# EAGLE design Swarm Board_3 (EAGLE 6.5.0)
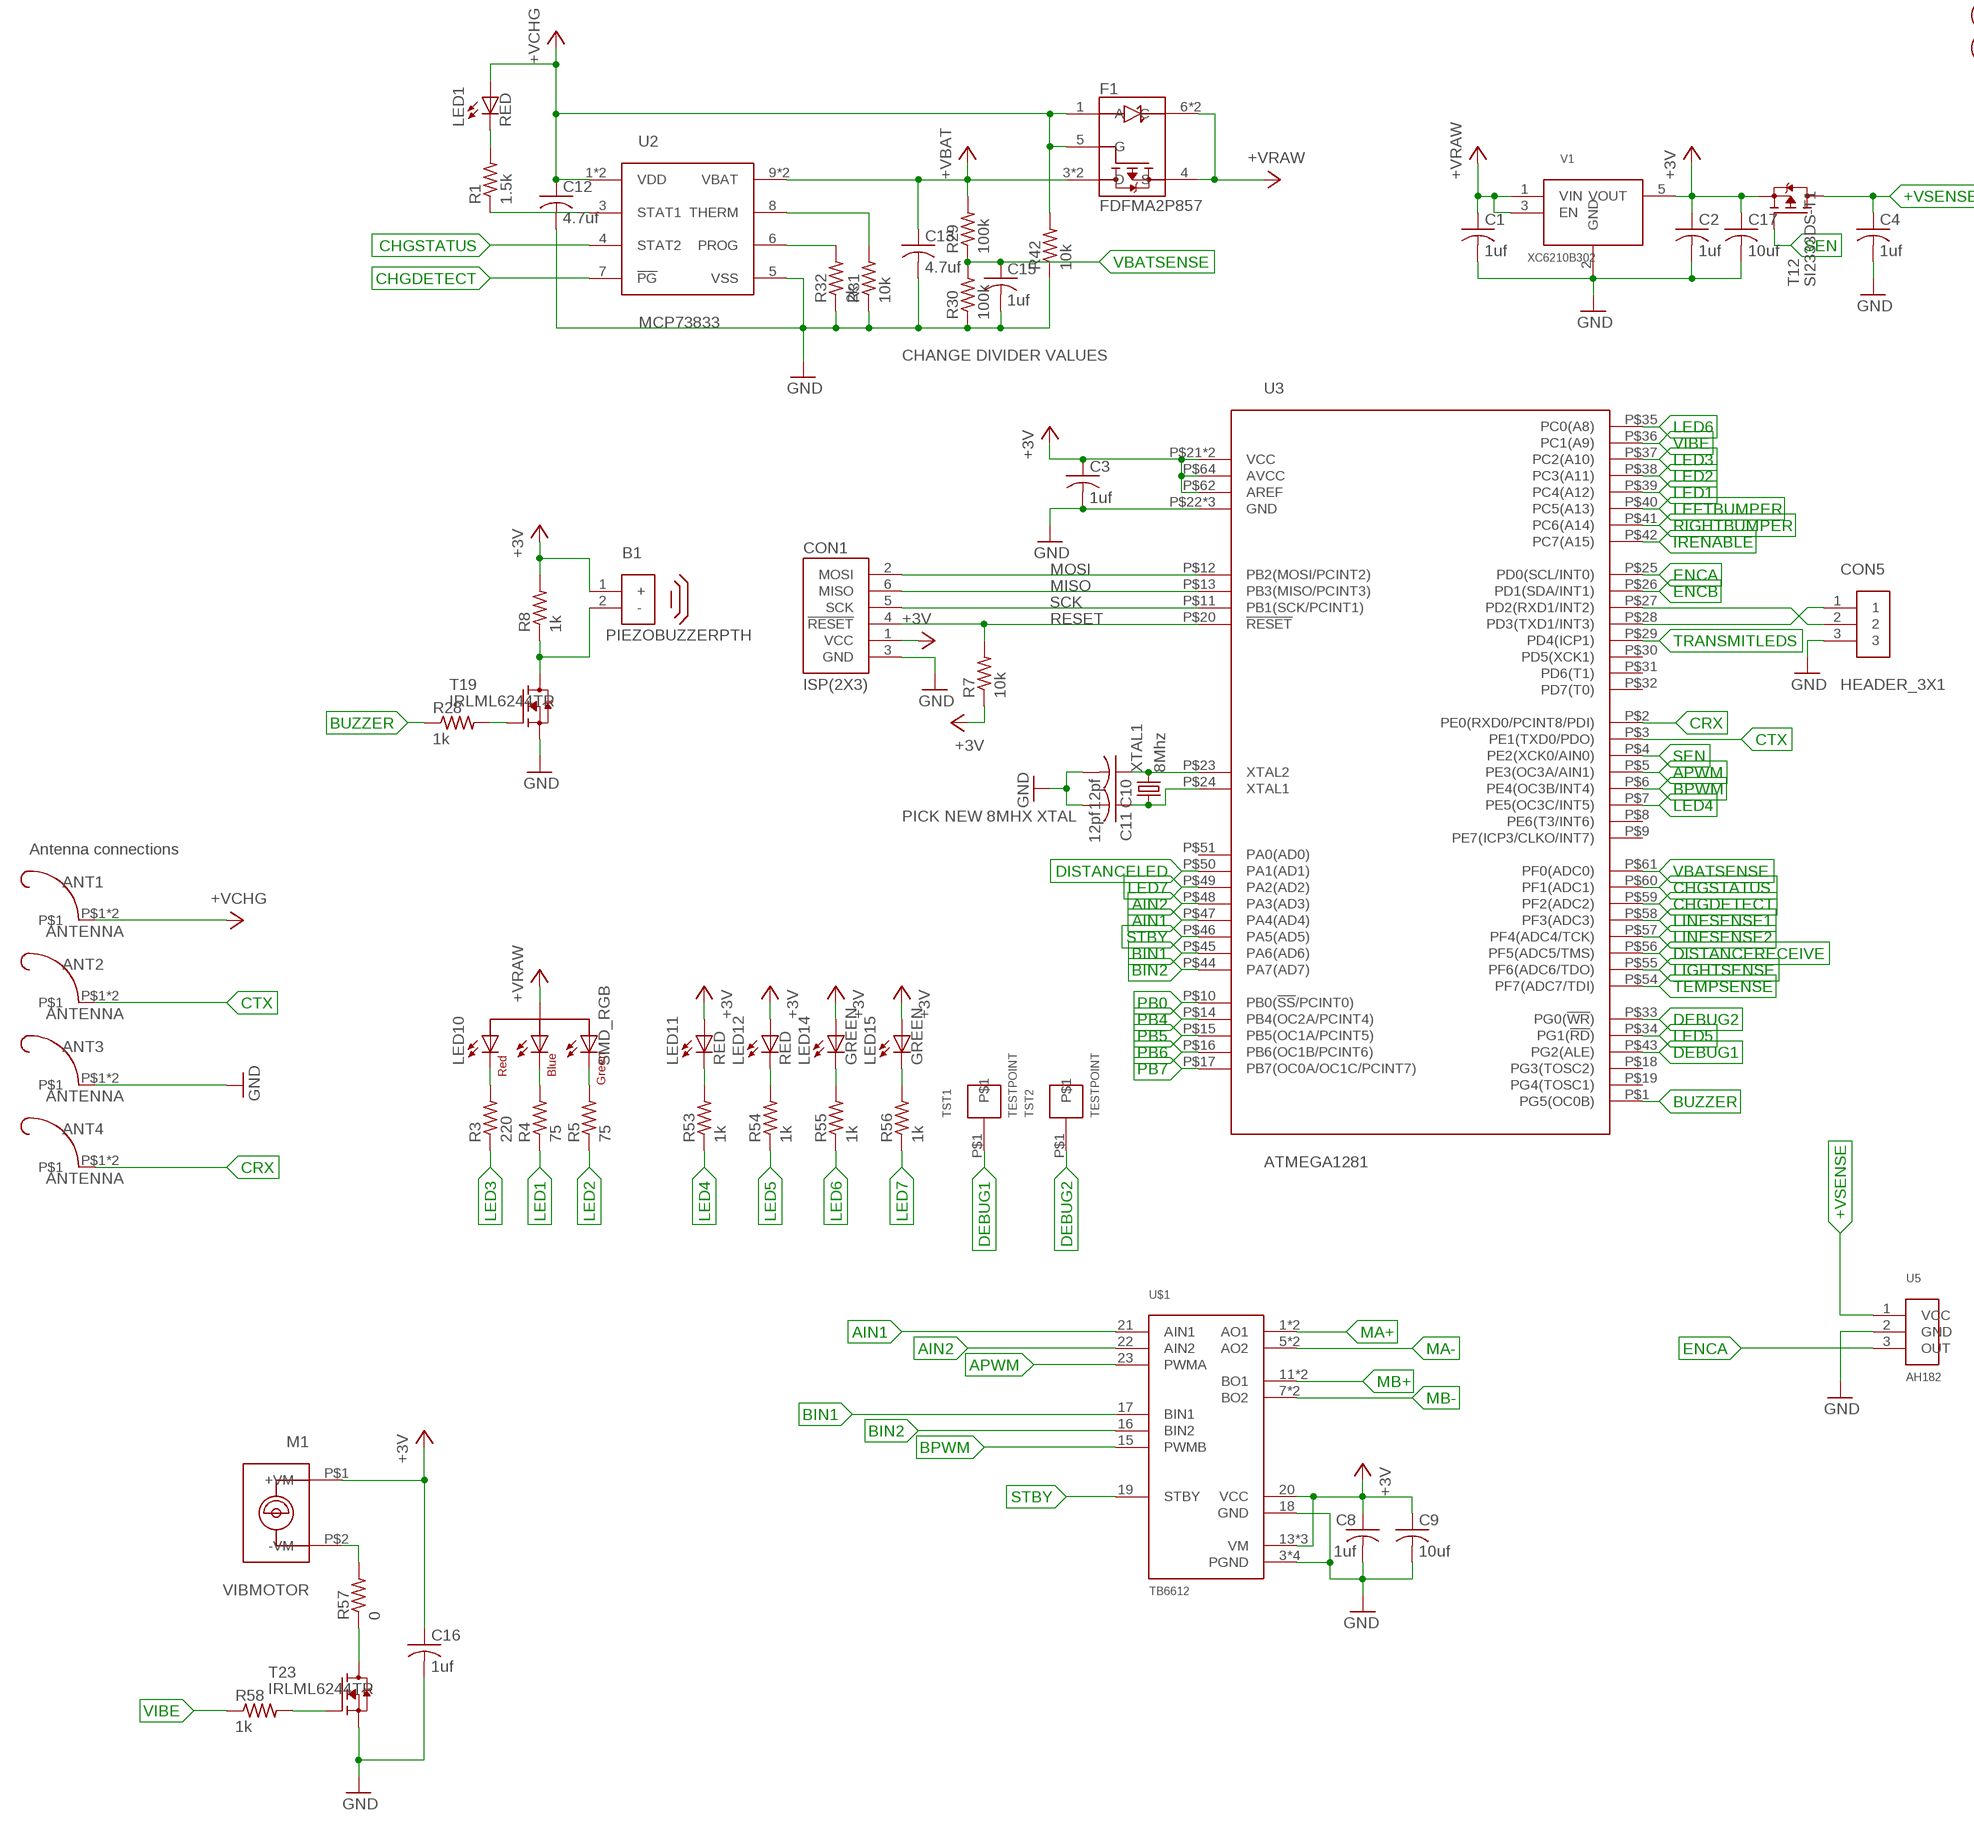
[diagram p0: schematic, sheet 1, part 1 of 2]
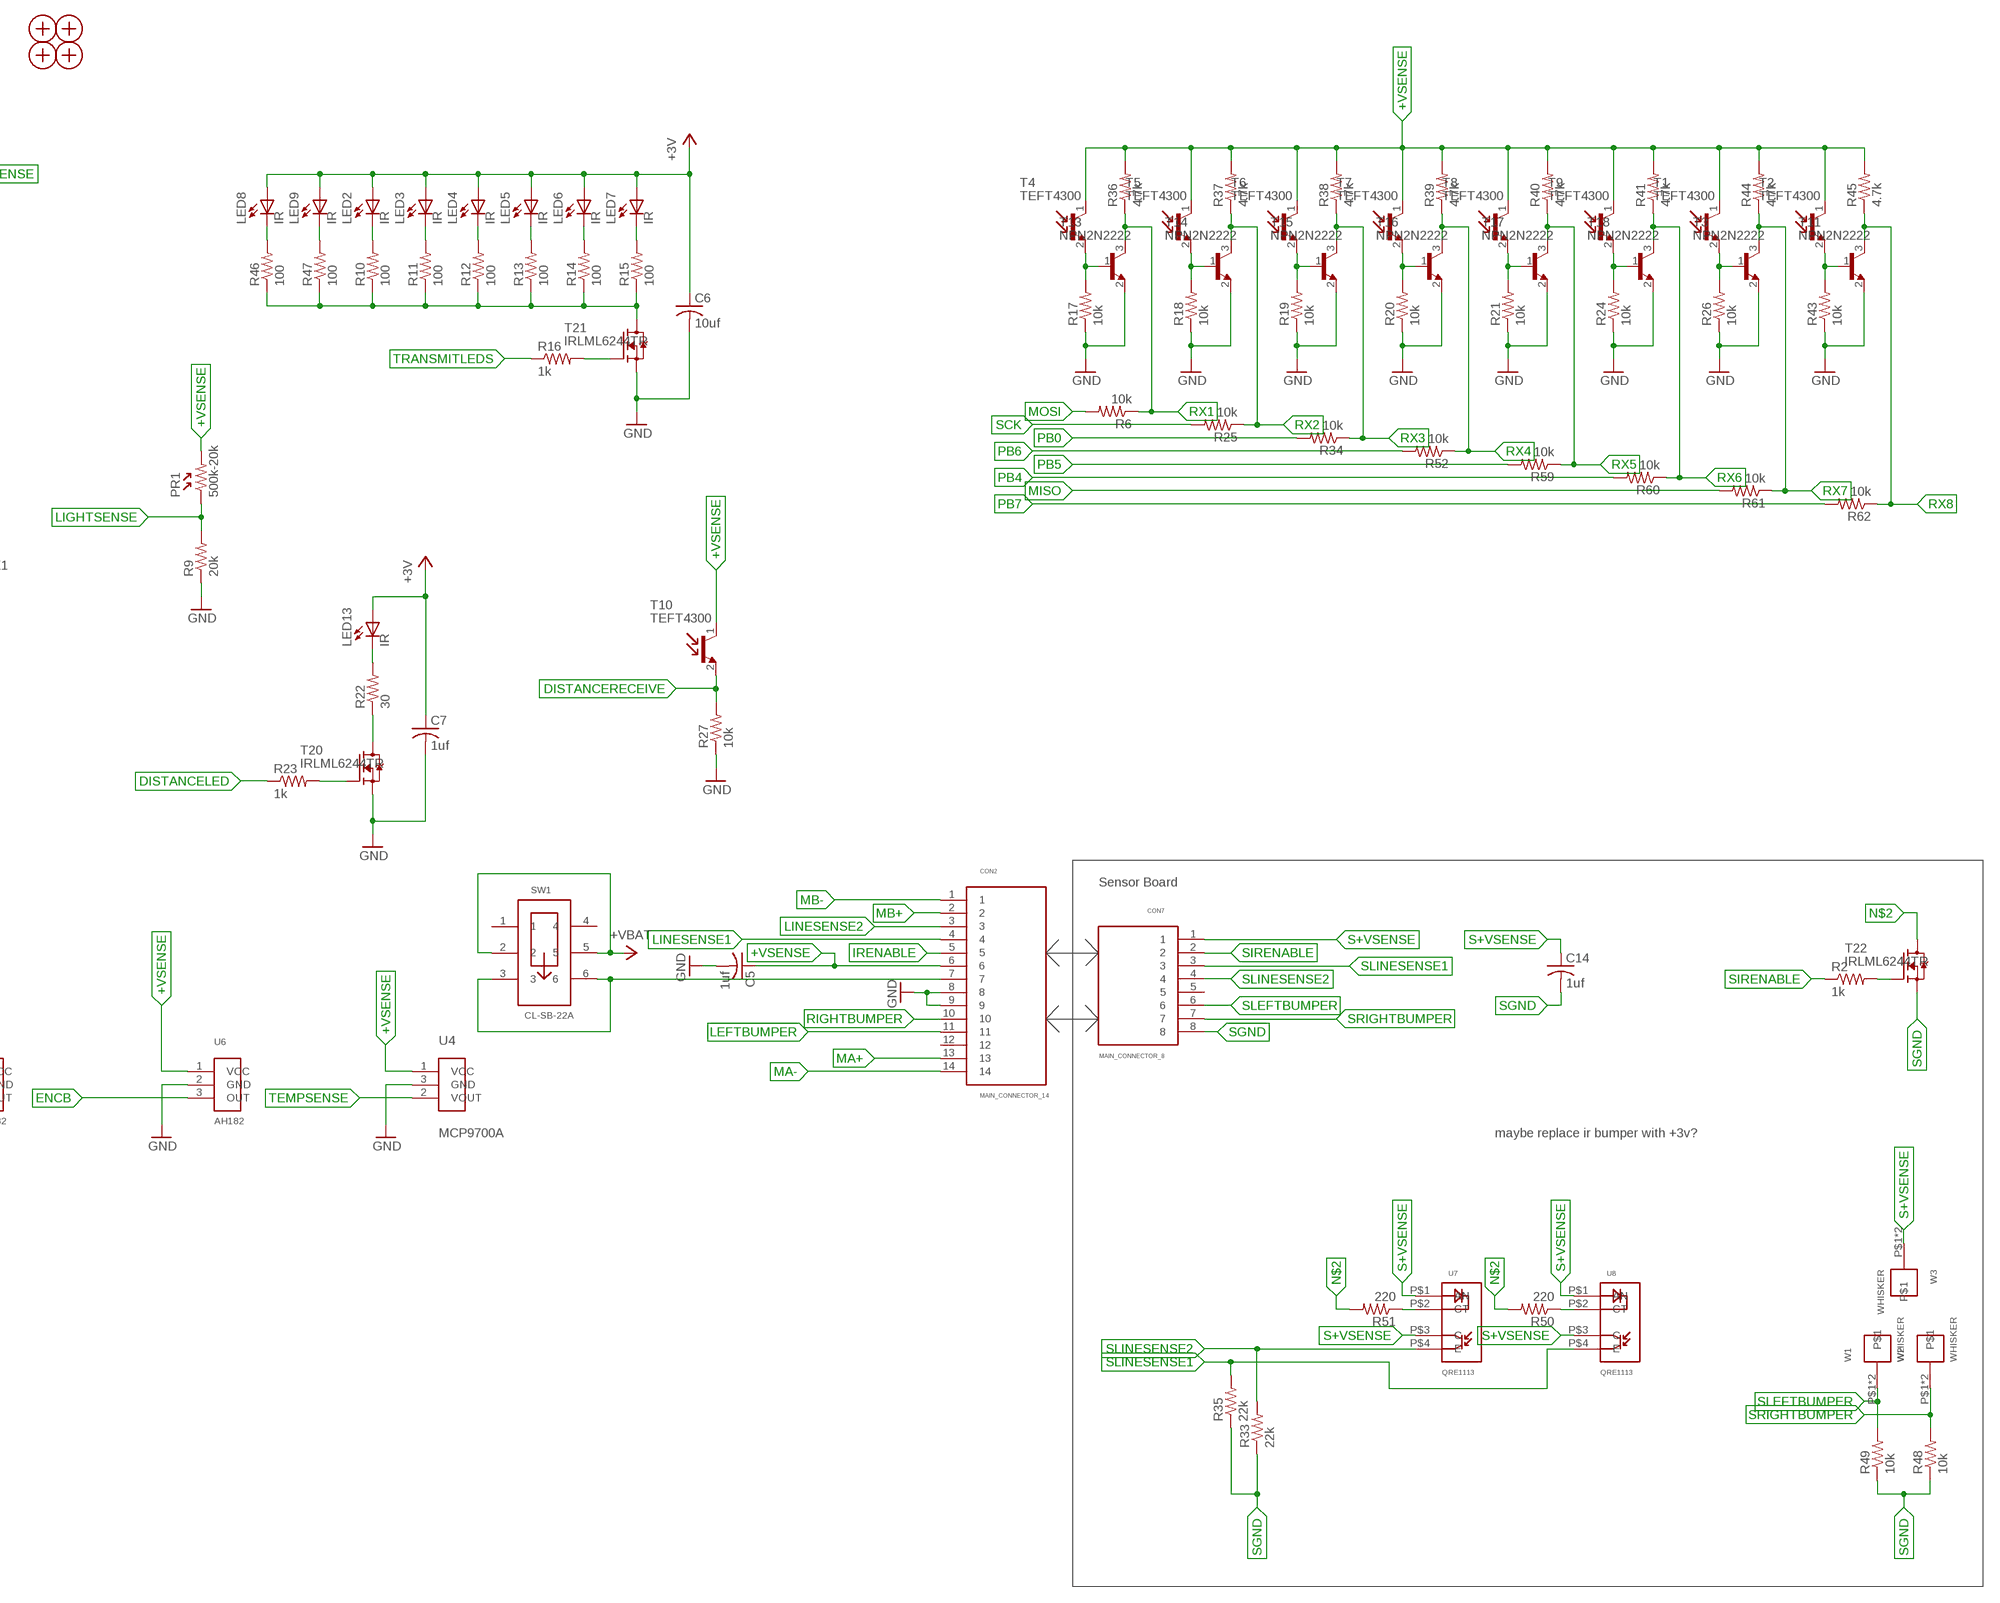
[diagram p1: schematic, sheet 1, part 2 of 2]

## Parts
ANT1  ANTENNA  [ANTENNA]
ANT2  ANTENNA  [ANTENNA]
ANT3  ANTENNA  [ANTENNA]
ANT4  ANTENNA  [ANTENNA]
B1  PIEZOBUZZERPTH  [PIEZOBUZZER]
C1  1uf  CAP0603  [0603]
C2  1uf  CAP0603  [0603]
C3  1uf  CAP0603  [0603]
C4  1uf  CAP0603  [0603]
C5  1uf  CAP0603  [0603]
C6  10uf  CAP0805  [0805]
C7  1uf  CAP0603  [0603]
C8  1uf  CAP0603  [0603]
C9  10uf  CAP0805  [0805]
C10  12pf  CAP0603  [0603]
C11  12pf  CAP0603  [0603]
C12  4.7uf  CAP0603  [0603]
C13  4.7uf  CAP0603  [0603]
C14  1uf  CAP0603  [0603]
C15  1uf  CAP0603  [0603]
C16  1uf  CAP0603  [0603]
C17  10uf  CAP0805  [0805]
CON1  ISP(2X3)  [PINHEADER(2X3)]
CON2  MAIN_CONNECTOR_14  [FEMALE_HEADER_2MM_2X7_SMD]
CON5  HEADER_3X1  [3PINHEADER_.100"]
CON7  MAIN_CONNECTOR_8  [FEMALE_HEADER_2MM_2X4]
F1  FDFMA2P857  [MICROFET2X2MM]
H1  MOUNTINGHOLE  [MOUNTINGHOLE]
H2  MOUNTINGHOLE  [MOUNTINGHOLE]
H3  MOUNTINGHOLE  [MOUNTINGHOLE]
H4  MOUNTINGHOLE  [MOUNTINGHOLE]
LED1  RED  LED0603  [LED0603]
LED2  IR  LED5MMRA  [5MM_LED_RA]
LED3  IR  LED5MMRA  [5MM_LED_RA]
LED4  IR  LED5MMRA  [5MM_LED_RA]
LED5  IR  LED5MMRA  [5MM_LED_RA]
LED6  IR  LED5MMRA  [5MM_LED_RA]
LED7  IR  LED5MMRA  [5MM_LED_RA]
LED8  IR  LED5MMRA  [5MM_LED_RA]
LED9  IR  LED5MMRA  [5MM_LED_RA]
LED10  SMD_RGB  [PLCC4]
LED11  RED  LED0603  [LED0603]
LED12  RED  LED0603  [LED0603]
LED13  IR  LED5MMRA  [5MM_LED_RA]
LED14  GREEN  LED0603  [LED0603]
LED15  GREEN  LED0603  [LED0603]
M1  VIBMOTOR  [VIBMOTOR]
PR1  500k-20k  CDSPHOTORESISTOR  [CDSPHOTOCELL]
R1  1.5k  RES0603  [0603]
R2  1k  RES0603  [0603]
R3  220  RES0603  [0603]
R4  75  RES0603  [0603]
R5  75  RES0603  [0603]
R6  10k  RES0603  [0603]
R7  10k  RES0603  [0603]
R8  1k  RES0603  [0603]
R9  20k  RES0603  [0603]
R10  100  RES0603  [0603]
R11  100  RES0603  [0603]
R12  100  RES0603  [0603]
R13  100  RES0603  [0603]
R14  100  RES0603  [0603]
R15  100  RES0603  [0603]
R16  1k  RES0603  [0603]
R17  10k  RES0603  [0603]
R18  10k  RES0603  [0603]
R19  10k  RES0603  [0603]
R20  10k  RES0603  [0603]
R21  10k  RES0603  [0603]
R22  30  RES0603  [0603]
R23  1k  RES0603  [0603]
R24  10k  RES0603  [0603]
R25  10k  RES0603  [0603]
R26  10k  RES0603  [0603]
R27  10k  RES0603  [0603]
R28  1k  RES0603  [0603]
R29  100k  RES0603  [0603]
R30  100k  RES0603  [0603]
R31  10k  RES0603  [0603]
R32  2k  RES0603  [0603]
R33  22k  RES0603  [0603]
R34  10k  RES0603  [0603]
R35  22k  RES0603  [0603]
R36  4.7k  RES0603  [0603]
R37  4.7k  RES0603  [0603]
R38  4.7k  RES0603  [0603]
R39  4.7k  RES0603  [0603]
R40  4.7k  RES0603  [0603]
R41  4.7k  RES0603  [0603]
R42  10k  RES0603  [0603]
R43  10k  RES0603  [0603]
R44  4.7k  RES0603  [0603]
R45  4.7k  RES0603  [0603]
R46  100  RES0603  [0603]
R47  100  RES0603  [0603]
R48  10k  RES0603  [0603]
R49  10k  RES0603  [0603]
R50  220  RES0603  [0603]
R51  220  RES0603  [0603]
R52  10k  RES0603  [0603]
R53  1k  RES0603  [0603]
R54  1k  RES0603  [0603]
R55  1k  RES0603  [0603]
R56  1k  RES0603  [0603]
R57  0  RES0603  [0603]
R58  1k  RES0603  [0603]
R59  10k  RES0603  [0603]
R60  10k  RES0603  [0603]
R61  10k  RES0603  [0603]
R62  10k  RES0603  [0603]
SW1  CL-SB-22A  [CL-SB-22A-01T]
T1  TEFT4300  [3MM_LED_RA]
T2  TEFT4300  [3MM_LED_RA]
T3  NPN2N2222  [SOT23]
T4  TEFT4300  [3MM_LED_RA]
T5  TEFT4300  [3MM_LED_RA]
T6  TEFT4300  [3MM_LED_RA]
T7  TEFT4300  [3MM_LED_RA]
T8  TEFT4300  [3MM_LED_RA]
T9  TEFT4300  [3MM_LED_RA]
T10  TEFT4300  [3MM_LED_RA]
T11  NPN2N2222  [SOT23]
T12  SI2333DS-T1  [SOT23]
T13  NPN2N2222  [SOT23]
T14  NPN2N2222  [SOT23]
T15  NPN2N2222  [SOT23]
T16  NPN2N2222  [SOT23]
T17  NPN2N2222  [SOT23]
T18  NPN2N2222  [SOT23]
T19  IRLML6244TR  [SOT23]
T20  IRLML6244TR  [SOT23]
T21  IRLML6244TR  [SOT23]
T22  IRLML6244TR  [SOT23]
T23  IRLML6244TR  [SOT23]
TST1  TESTPOINT  [TESTPOINT]
TST2  TESTPOINT  [TESTPOINT]
U2  MCP73833  [MSOP10]
U3  ATMEGA1281  [TQFP64]
U4  MCP9700A  [SOT23]
U5  AH182  [3PINHEADER_.100"]
U6  AH182  [3PINHEADER_.100"]
U7  QRE1113  [QRE1113]
U8  QRE1113  [QRE1113]
U$1  TB6612  [24SSOP]
V1  XC6210B302  [(OT)SOT-23(5PAD)]
W1  WHISKER  [WHISKER]
W2  WHISKER  [WHISKER]
W3  WHISKER  [WHISKER]
XTAL1  8Mhz  NX5032GA-10.000000MHZ  [SMDXTAL]

## Nets
+3V: B1.1(+) C2.1 C3.1 C6.1 C7.1 C8.1 C9.1 C16.1 C17.1 CON1.1(VCC) LED2.1(A) LED3.1(A) LED4.1(A) LED5.1(A) LED6.1(A) LED7.1(A) LED8.1(A) LED9.1(A) LED11.2(A) LED12.2(A) LED13.1(A) LED14.2(A) LED15.2(A) M1.P$1(+VM) R7.1 R8.2 T12.2(S) U3.P$21(VCC) U3.P$52(VCC) U3.P$62(AREF) U3.P$64(AVCC) U$1.13(VM) U$1.14(VM) U$1.20(VCC) U$1.24(VM) V1.5(VOUT)
+VBAT: C13.1 F1.3(D) F1.8(D) R29.2 SW1.2 SW1.5 U2.9(VBAT) U2.10(VBAT)
+VCHG: ANT1.P$1 ANT1.P$2 C12.1 F1.1(A) F1.5(G) LED1.2(A) R42.2 U2.1(VDD) U2.2(VDD)
+VRAW: C1.1 F1.4(S) F1.6(C) F1.7(C) LED10.2(COMMONANODE) V1.1(VIN) V1.3(EN)
+VSENSE: C4.1 C5.1 CON2.6 PR1.2 R36.2 R37.2 R38.2 R39.2 R40.2 R41.2 R44.2 R45.2 T1.1(C) T2.1(C) T4.1(C) T5.1(C) T6.1(C) T7.1(C) T8.1(C) T9.1(C) T10.1(C) T12.3(D) U4.1(VCC) U5.1(VCC) U6.1(VCC)
AIN1: U3.P$47(PA4(AD4)) U$1.21(AIN1)
AIN2: U3.P$48(PA3(AD3)) U$1.22(AIN2)
APWM: U3.P$5(PE3(OC3A/AIN1)) U$1.23(PWMA)
BIN1: U3.P$45(PA6(AD6)) U$1.17(BIN1)
BIN2: U3.P$44(PA7(AD7)) U$1.16(BIN2)
BPWM: U3.P$6(PE4(OC3B/INT4)) U$1.15(PWMB)
BUZZER: R28.1 U3.P$1(PG5(OC0B))
CHGDETECT: U2.7(!PG) U3.P$59(PF2(ADC2))
CHGSTATUS: U2.4(STAT2) U3.P$60(PF1(ADC1))
CRX: ANT4.P$1 ANT4.P$2 U3.P$2(PE0(RXD0/PCINT8/PDI))
CTX: ANT2.P$1 ANT2.P$2 U3.P$3(PE1(TXD0/PDO))
DATAANTENNA: CON5.1 U3.P$28(PD3(TXD1/INT3))
DEBUG1: TST1.P$1 U3.P$43(PG2(ALE))
DEBUG2: TST2.P$1 U3.P$33(PG0(!WR!))
DISTANCELED: R23.1 U3.P$50(PA1(AD1))
DISTANCERECEIVE: R27.2 T10.2(E) U3.P$56(PF5(ADC5/TMS))
ENCA: U3.P$25(PD0(SCL/INT0)) U5.3(OUT)
ENCB: U3.P$26(PD1(SDA/INT1)) U6.3(OUT)
GND: ANT3.P$1 ANT3.P$2 C1.2 C2.2 C3.2 C4.2 C5.2 C6.2 C7.2 C8.2 C9.2 C10.2 C11.2 C12.2 C13.2 C15.2 C16.2 C17.2 CON1.3(GND) CON2.8 CON2.9 CON5.3 R9.1 R17.1 R18.1 R19.1 R20.1 R21.1 R24.1 R26.1 R27.1 R30.1 R31.1 R32.1 R42.1 R43.1 T3.2(E) T11.2(E) T13.2(E) T14.2(E) T15.2(E) T16.2(E) T17.2(E) T18.2(E) T19.2(S) T20.2(S) T21.2(S) T23.2(S) U2.5(VSS) U3.P$22(GND) U3.P$53(GND) U3.P$63(GND) U4.3(GND) U5.2(GND) U6.2(GND) U$1.3(PGND) U$1.4(PGND) U$1.9(PGND) U$1.10(PGND) U$1.18(GND) V1.2(GND)
IRENABLE: CON2.5 U3.P$42(PC7(A15))
LED1: R4.1 U3.P$39(PC4(A12))
LED2: R5.1 U3.P$38(PC3(A11))
LED3: R3.1 U3.P$37(PC2(A10))
LED4: R53.1 U3.P$7(PE5(OC3C/INT5))
LED5: R54.1 U3.P$34(PG1(!RD!))
LED6: R55.1 U3.P$35(PC0(A8))
LED7: R56.1 U3.P$49(PA2(AD2))
LEFTBUMPER: CON2.11 U3.P$40(PC5(A13))
LIGHTSENSE: PR1.1 R9.2 U3.P$55(PF6(ADC6/TDO))
LINESENSE1: CON2.4 U3.P$58(PF3(ADC3))
LINESENSE2: CON2.3 U3.P$57(PF4(ADC4/TCK))
MA+: CON2.13 U$1.1(AO1) U$1.2(AO1)
MA-: CON2.14 U$1.5(AO2) U$1.6(AO2)
MB+: CON2.2 U$1.11(BO1) U$1.12(BO1)
MB-: CON2.1 U$1.7(BO2) U$1.8(BO2)
MISO: CON1.6(MISO) R61.2 U3.P$13(PB3(MISO/PCINT3))
MOSI: CON1.2(MOSI) R6.2 U3.P$12(PB2(MOSI/PCINT2))
N$1: LED1.1(C) R1.2
N$2: R50.2 R51.2 T22.3(D)
N$3: R43.2 T2.2(E) T11.1(B)
N$4: R2.2 T22.1(G)
N$5: CON2.7 SW1.3 SW1.6
N$6: R26.2 T1.2(E) T3.1(B)
N$7: R57.1 T23.3(D)
N$8: CON5.2 U3.P$27(PD2(RXD1/INT2))
N$9: B1.2(-) R8.1 T19.3(D)
N$10: R10.1 R11.1 R12.1 R13.1 R14.1 R15.1 R46.1 R47.1 T21.3(D)
N$11: R16.2 T21.1(G)
N$12: R22.1 T20.3(D)
N$13: LED2.2(C) R10.2
N$14: LED3.2(C) R11.2
N$15: LED4.2(C) R12.2
N$16: LED5.2(C) R13.2
N$17: LED6.2(C) R14.2
N$18: LED7.2(C) R15.2
N$19: R23.2 T20.1(G)
N$20: LED8.2(C) R46.2
N$21: LED9.2(C) R47.2
N$22: R31.2 U2.8(THERM)
N$23: C10.1 U3.P$23(XTAL2) XTAL1.2
N$24: C11.1 U3.P$24(XTAL1) XTAL1.1
N$25: LED13.2(C) R22.2
N$26: R28.2 T19.1(G)
N$27: R17.2 T4.2(E) T13.1(B)
N$28: R32.2 U2.6(PROG)
N$29: R51.1 U7.P$2(CT)
N$30: LED10.1(REDCATHODE) R3.2
N$31: LED10.3(BLUECATHODE) R4.2
N$32: LED10.4(GREENCATHODE) R5.2
N$33: R1.1 U2.3(STAT1)
N$34: R24.2 T9.2(E) T18.1(B)
N$35: R21.2 T8.2(E) T17.1(B)
N$36: R20.2 T7.2(E) T16.1(B)
N$37: R19.2 T6.2(E) T15.1(B)
N$38: R18.2 T5.2(E) T14.1(B)
N$39: R50.1 U8.P$2(CT)
N$43: LED11.1(C) R53.2
N$44: R58.2 T23.1(G)
N$45: LED12.1(C) R54.2
N$46: LED14.1(C) R55.2
N$47: LED15.1(C) R56.2
N$48: M1.P$2(-VM) R57.2
PB0: R34.2 U3.P$10(PB0(!SS!/PCINT0))
PB4: R60.2 U3.P$14(PB4(OC2A/PCINT4))
PB5: R59.2 U3.P$15(PB5(OC1A/PCINT5))
PB6: R52.2 U3.P$16(PB6(OC1B/PCINT6))
PB7: R62.2 U3.P$17(PB7(OC0A/OC1C/PCINT7))
RESET: CON1.4(!RESET) R7.2 U3.P$20(!RESET!)
RIGHTBUMPER: CON2.10 U3.P$41(PC6(A14))
RX1: R6.1 R36.1 T13.3(C)
RX2: R25.1 R37.1 T14.3(C)
RX3: R34.1 R38.1 T15.3(C)
RX4: R39.1 R52.1 T16.3(C)
RX5: R40.1 R59.1 T17.3(C)
RX6: R41.1 R60.1 T18.3(C)
RX7: R44.1 R61.1 T3.3(C)
RX8: R45.1 R62.1 T11.3(C)
S+VSENSE: C14.1 CON7.1 U7.P$1(AN) U7.P$3(C) U8.P$1(AN) U8.P$3(C) W3.P$1 W3.P$2
SCK: CON1.5(SCK) R25.2 U3.P$11(PB1(SCK/PCINT1))
SEN: T12.1(G) U3.P$4(PE2(XCK0/AIN0))
SGND: C14.2 CON7.8 R33.1 R35.1 R48.1 R49.1 T22.2(S)
SIRENABLE: CON7.2 R2.1
SLEFTBUMPER: CON7.6 R49.2 W1.P$1 W1.P$2
SLINESENSE1: CON7.3 R35.2 U8.P$4(E)
SLINESENSE2: CON7.4 R33.2 U7.P$4(E)
SRIGHTBUMPER: CON7.7 R48.2 W2.P$1 W2.P$2
STBY: U3.P$46(PA5(AD5)) U$1.19(STBY)
TEMPSENSE: U3.P$54(PF7(ADC7/TDI)) U4.2(VOUT)
TRANSMITLEDS: R16.1 U3.P$29(PD4(ICP1))
VBATSENSE: C15.1 R29.1 R30.2 U3.P$61(PF0(ADC0))
VIBE: R58.1 U3.P$36(PC1(A9))
Unconnected: CON2.12 CON7.5 SW1.1 SW1.4 U3.P$8(PE6(T3/INT6)) U3.P$9(PE7(ICP3/CLKO/INT7)) U3.P$18(PG3(TOSC2)) U3.P$19(PG4(TOSC1)) U3.P$30(PD5(XCK1)) U3.P$31(PD6(T1)) U3.P$32(PD7(T0)) U3.P$51(PA0(AD0))

## Notes on the sheet
- CHANGE DIVIDER VALUES
- PICK NEW 8MHX XTAL
- Antenna connections
- Sensor Board
- maybe replace ir bumper with +3v?

## Library data of the parts
ANT1-ANT4 = Mechanical:ANTENNA
B1 = Passive:PIEZOBUZZER: Digikey Part Number: 445-2525-1-ND Manufacturer Part Number: PS1240P02BT
C1-C17 = Passive:CAP
CON1 = Mechanical:ISP
CON2 = Mechanical:MAIN_CONNECTOR_14: Digikey Part Number: H10965-ND Manufacturer Part Number: A3-14DA-2SV(71)
CON5 = Mechanical:HEADER_3X1
CON7 = Mechanical:MAIN_CONNECTOR_8: Digikey Part Number: H10962-ND Manufacturer Part Number: A3-8DA-2SV(71)
F1 = Passive:FDFMA2P857: Digikey Part Number: FDFMA2P857CT-ND Manufacturer Part Number: FDFMA2P857
H1-H4 = Mechanical:MOUNTINGHOLE
LED1-LED9 LED11-LED15 = Passive:LED
LED10 = Passive:SMD_RGB: Digikey Part Number: CLVBA-FKA-CAEDH8BBB7A363CT-ND Manufacturer Part Number: CLVBA-FKA-CAEDH8BBB7A363
M1 = Mechanical:VIBMOTOR: Pololu Part Number: 2265
PR1 = Passive:CDSPHOTORESISTOR: Digikey Part Number: PDV-P8103-ND Manufacturer Part Number: PDV-P8103
R1-R62 = Passive:RES
SW1 = Mechanical:CL-SB-22A: Digikey Part Number: 563-1338-1-ND Manufacturer Part Number: CL-SB-22A-01T
T1 T2 T4-T10 = Passive:TEFT4300: Digikey Part Number: 751-1041-ND Manufacturer Part number: TEFT4300
T3 T11 T13-T18 = Passive:NPN2N2222: Digikey Part Number: 568-1738-1-ND Manufacturer Part Number: PMBT2222A,215
T12 = Passive:SI2333DS-T1: Digikey Part Number: SI2333DS-T1-E3CT-ND Manufacturer Part Number: SI2333DS-T1-E3
T19-T23 = Passive:IRLML6244TR: Digikey Part Number: IRLML6244TRPBFCT-ND Manufacturer Part Number: IRLML6244TRPBF
TST1 TST2 = Mechanical:TESTPOINT
U2 = PowerIC:MCP73833: Manufacturer Part Number: MCP73833-AMI/UN Mouser Part Number: 579-MCP73833-AMI/UN
U3 = DigitalIC:ATMEGA1281: Digikey Part Number: ATMEGA1281V-8AU-ND Manufacturer Part Number: ATMEGA1281V-8AU
U4 = Passive:MCP9700A: Digikey Part Number: MCP9700AT-E/TTCT-ND Manufacturer Part Number: MCP9700AT-E/TT
U5 U6 = Passive:AH182: Digikey Part Number: AH182-PL-ADICT-ND Manufacturer Part Number: AH182-PL-A UPDATE PACKAGE PLACEHOLDER
U7 U8 = Passive:QRE1113: Digikey Part Number: QRE1113-ND Manufacturer Part Number: QRE1113
U$1 = DigitalIC:TB6612
V1 = PowerIC:XC6210B302: Digikey Part Number: 893-1074-1-ND Manufacturer Part Number: XC6210B302MR-G
W1-W3 = Mechanical:WHISKER
XTAL1 = Passive:NX5032GA-10.000000MHZ: Digikey Part Number: 644-1033-1-ND Manufacturer Part Number: NX5032GA-10.000000MHZ-LN-CD-1

## Board
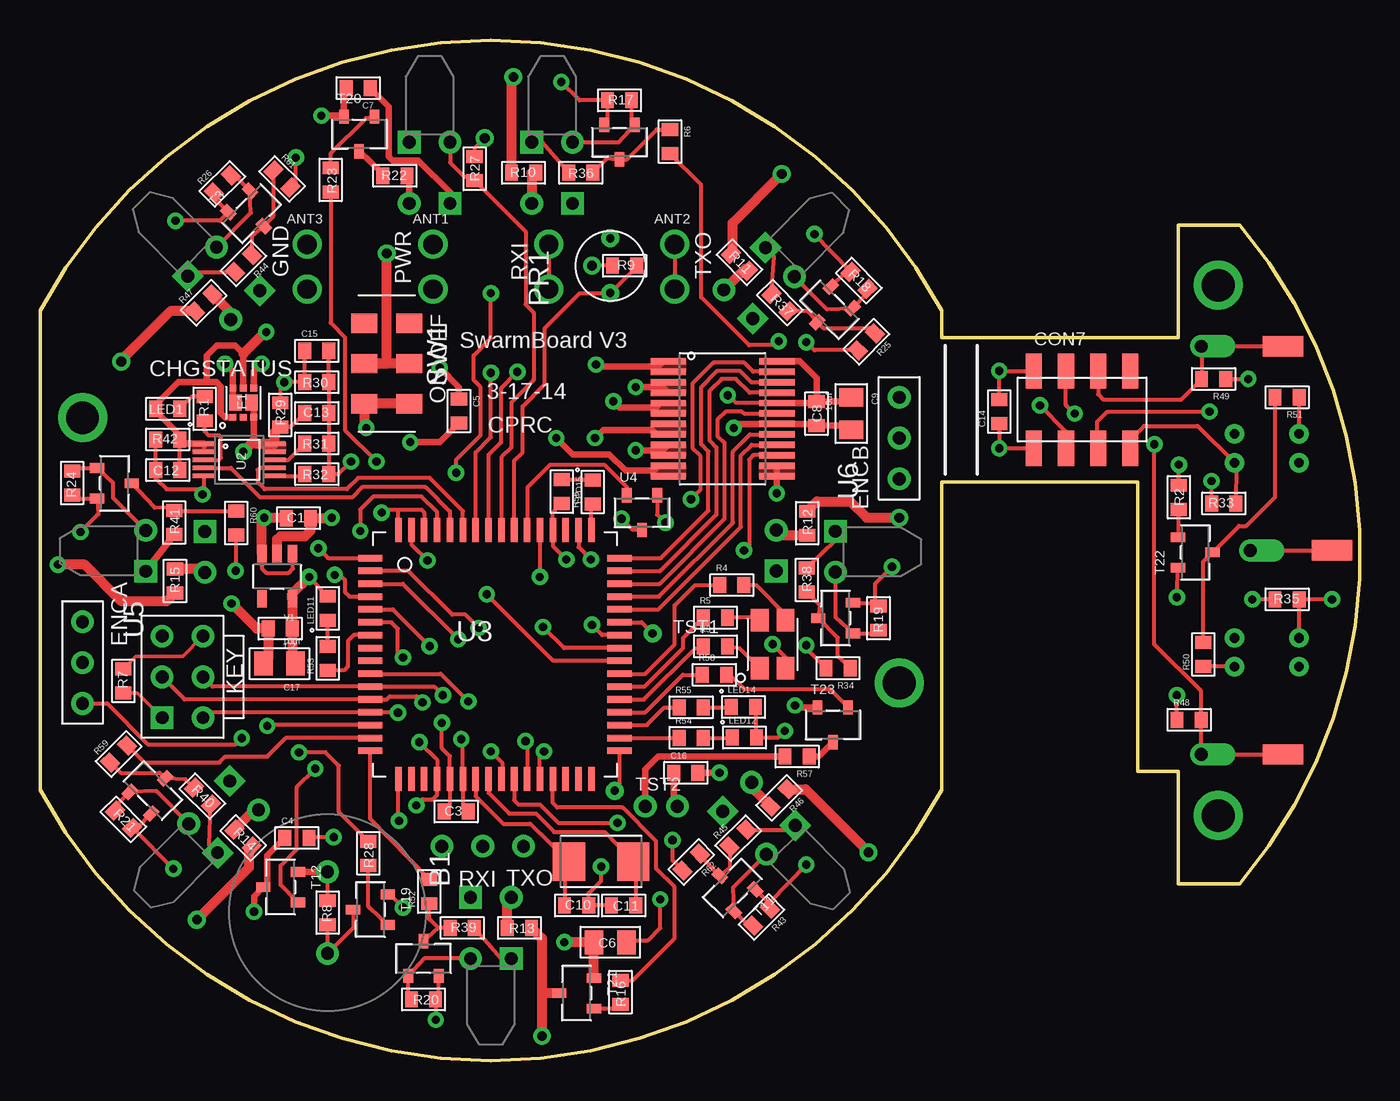
[diagram p2: board, top side]
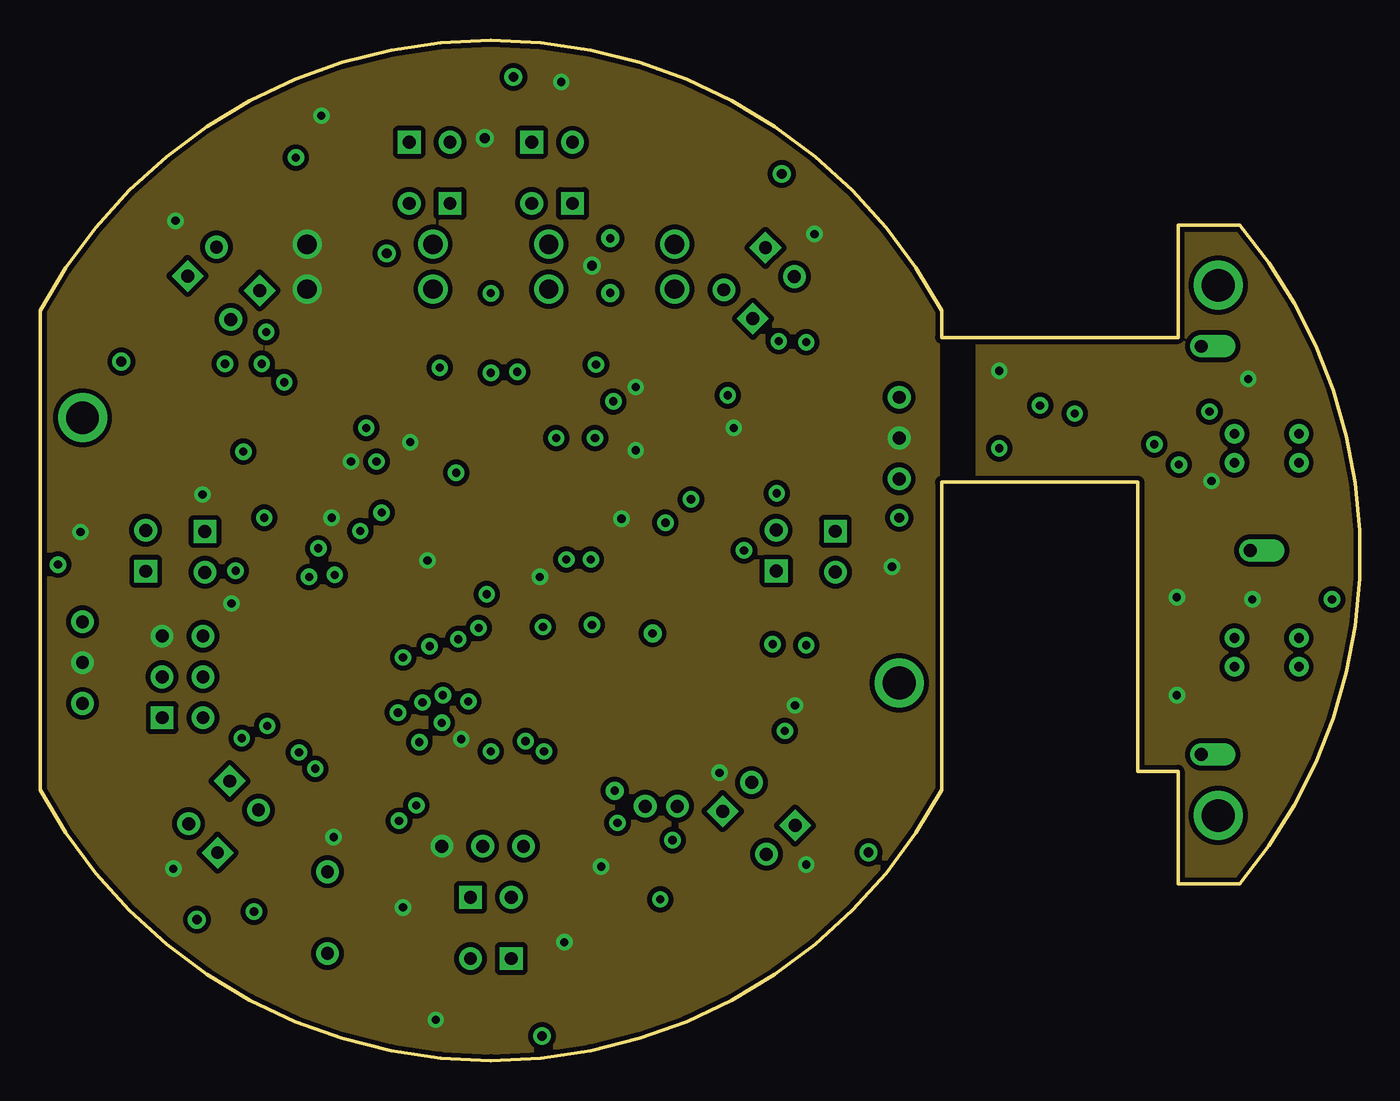
[diagram p3: board, inner layer Route2]
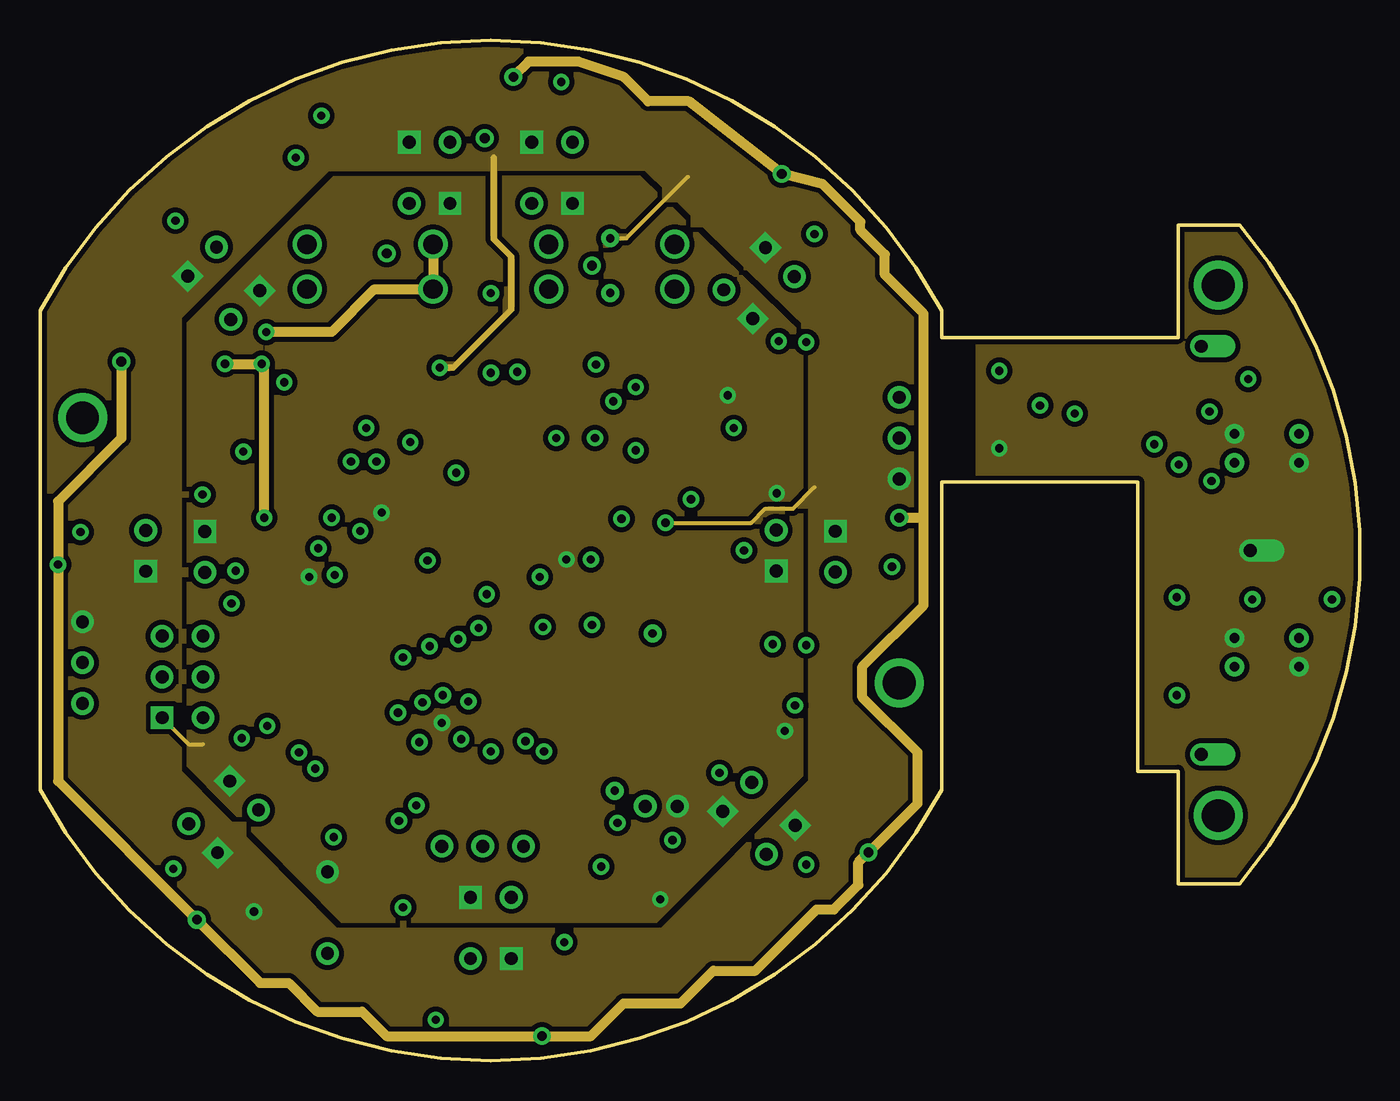
[diagram p4: board, inner layer Route15]
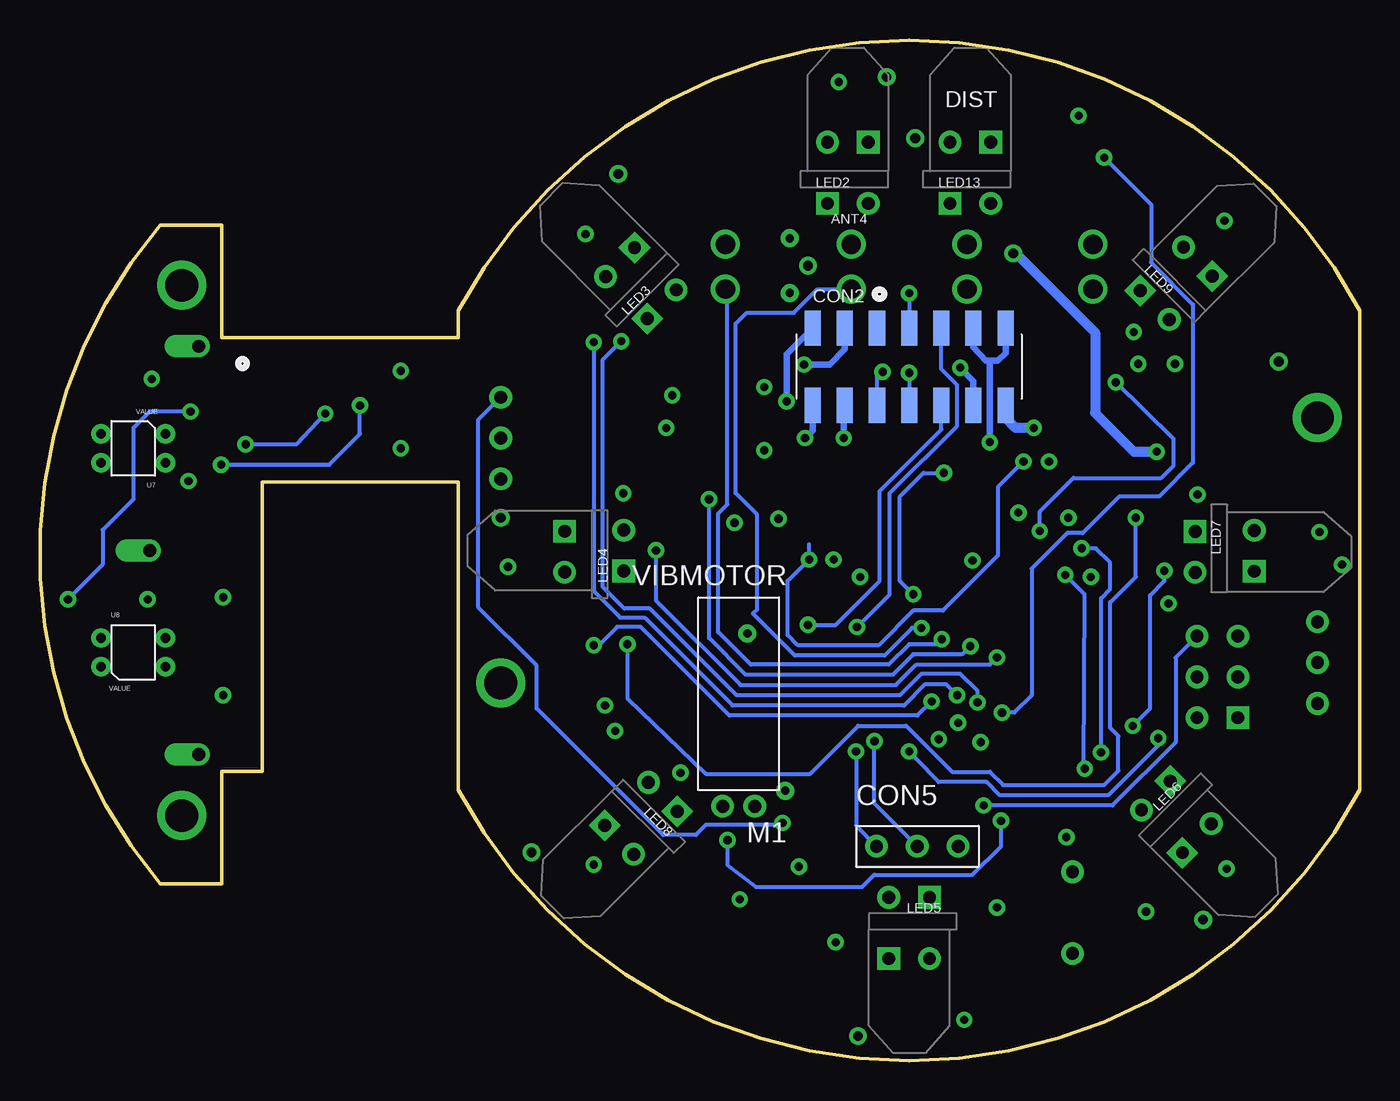
[diagram p5: board, bottom side, seen from below]

Size 82.08 x 63.5 mm. Coordinates in mm from the lower left corner, seen from the top.
Outline: 0,46.66 0,16.84 arc124 56.07,16.84 56.07,36 68.28,36 68.28,18 70.78,18 70.78,11 74.61,11 arc80 74.61,52 70.78,52 70.78,45 56.07,45 56.07,46.66 arc124 0,46.66
Copper layers (1*2*15*16): Top 0.035mm / dielectric 1.5mm / Route2 0.035mm / dielectric 0.15mm / Route15 0.035mm / dielectric 0.2mm / Bottom 0.035mm
Design rules "SparkFunDRC *": minimum track width 8mil, minimum drill 20mil, track to track 8mil, track to pad 8mil, pad to pad 8mil, via to via 8mil, smd to smd 8mil, copper to edge 10mil, drill to drill 8mil, minimum pad ring 12mil, minimum via ring 10mil, stop-mask expansion 4mil, vias tented up to drill 25mil, thermal gap 10mil

### Footprints (pad centres in the part's own frame; a part is rotated, then mirrored left to right if it is on the bottom)
ANTENNA = drill 1.2: P$1 0,0; P$2 0,-2.794
PIEZOBUZZER = drill 0.8: 1 -2.54,0; 2 2.54,0
0603 = smd 0.8 x 1: 1 -0.75,0; 2 0.75,0
0805 = smd 1.15 x 1.5: 1 -1,0; 2 1,0
PINHEADER(2X3) = drill 0.8 square: 1 -2.54,1.27 | drill 0.8: 2 0,1.27; 3 2.54,1.27; 4 2.54,-1.27; 5 0,-1.27; 6 -2.54,-1.27
FEMALE_HEADER_2MM_2X7_SMD = smd 1 x 2.2: 1 -6,-2.4; 2 -4,-2.4; 3 -2,-2.4; 4 0,-2.4; 5 2,-2.4; 6 4,-2.4; 7 6,-2.4; 8 6,2.4; 9 4,2.4; 10 2,2.4; 11 0,2.4; 12 -2,2.4; 13 -4,2.4; 14 -6,2.4
3PINHEADER_.100" = drill 0.8: 1 -2.54,0; 2 0,0; 3 2.54,0
FEMALE_HEADER_2MM_2X4 = smd 1 x 2.2: 1 -3,-2.4; 2 -1,-2.4; 3 1,-2.4; 4 3,-2.4; 5 3,2.4; 6 1,2.4; 7 -1,2.4; 8 -3,2.4
MICROFET2X2MM = smd 0.42 x 0.42: 1 -0.65,-0.915; 2 0,-0.915; 3 0.65,-0.915; 4 0.65,0.915; 5 0,0.915; 6 -0.65,0.915 | smd 0.78 x 1: 7 -0.5,0; 8 0.5,0
MOUNTINGHOLE = drill 2.032 pad 2.286: P$2 0,0
LED0603 = smd 0.8 x 1: 1 -0.75,0; 2 0.75,0
5MM_LED_RA = drill 0.8 square: 1 -1.27,0 | drill 0.8: 2 1.27,0
PLCC4 = smd 1.4 x 1.1: 1 -1.5,0.8; 2 -1.5,-0.8; 3 1.5,-0.8; 4 1.5,0.8
VIBMOTOR = drill 0.8: P$1 -1,1; P$2 1,1
CDSPHOTOCELL = drill 0.508: 1 -1.694,0; 2 1.702,0
CL-SB-22A-01T = smd 1.2 x 1.6: 1 -2.5,-1.4; 2 0,-1.4; 3 2.5,-1.4; 4 -2.5,1.4; 5 0,1.4; 6 2.5,1.4
3MM_LED_RA = drill 0.8 square: 1 -1.27,0 | drill 0.8: 2 1.27,0
SOT23 = smd 0.6 x 0.889: 1 0.95,1.079; 2 -0.95,1.079; 3 0,-1.079
TESTPOINT = drill 0.508: P$1 0,0
MSOP10 = smd 0.28 x 1.4: 1 -1,-2.2; 2 -0.5,-2.2; 3 0,-2.2; 4 0.5,-2.2; 5 1,-2.2; 6 1,2.2; 7 0.5,2.2; 8 0,2.2; 9 -0.5,2.2; 10 -1,2.2
TQFP64 = smd 1.5 x 0.406: P$1 -7.75,6; P$2 -7.75,5.2; P$3 -7.75,4.4; P$4 -7.75,3.6; P$5 -7.75,2.8; P$6 -7.75,2; P$7 -7.75,1.2; P$8 -7.75,0.4; P$9 -7.75,-0.4; P$10 -7.75,-1.2; P$11 -7.75,-2; P$12 -7.75,-2.8; P$13 -7.75,-3.6; P$14 -7.75,-4.4; P$15 -7.75,-5.2; P$16 -7.75,-6; P$33 7.75,-6; P$34 7.75,-5.2; P$35 7.75,-4.4; P$36 7.75,-3.6; P$37 7.75,-2.8; P$38 7.75,-2; P$39 7.75,-1.2; P$40 7.75,-0.4; P$41 7.75,0.4; P$42 7.75,1.2; P$43 7.75,2; P$44 7.75,2.8; P$45 7.75,3.6; P$46 7.75,4.4; P$47 7.75,5.2; P$48 7.75,6 | smd 0.406 x 1.5: P$17 -6,-7.75; P$18 -5.2,-7.75; P$19 -4.4,-7.75; P$20 -3.6,-7.75; P$21 -2.8,-7.75; P$22 -2,-7.75; P$23 -1.2,-7.75; P$24 -0.4,-7.75; P$25 0.4,-7.75; P$26 1.2,-7.75; P$27 2,-7.75; P$28 2.8,-7.75; P$29 3.6,-7.75; P$30 4.4,-7.75; P$31 5.2,-7.75; P$32 6,-7.75; P$49 6,7.75; P$50 5.2,7.75; P$51 4.4,7.75; P$52 3.6,7.75; P$53 2.8,7.75; P$54 2,7.75; P$55 1.2,7.75; P$56 0.4,7.75; P$57 -0.4,7.75; P$58 -1.2,7.75; P$59 -2,7.75; P$60 -2.8,7.75; P$61 -3.6,7.75; P$62 -4.4,7.75; P$63 -5.2,7.75; P$64 -6,7.75
QRE1113 = drill 0.6: P$1 -2,-0.9; P$2 2,-0.9; P$3 2,0.9; P$4 -2,0.9
24SSOP = smd 0.4 x 2.2: 1 -3.575,-3.378; 2 -2.925,-3.378; 3 -2.275,-3.378; 4 -1.625,-3.378; 5 -0.975,-3.378; 6 -0.325,-3.378; 7 0.325,-3.378; 8 0.975,-3.378; 9 1.625,-3.378; 10 2.275,-3.378; 11 2.925,-3.378; 12 3.575,-3.378; 13 3.575,3.378; 14 2.925,3.378; 15 2.275,3.378; 16 1.625,3.378; 17 0.975,3.378; 18 0.325,3.378; 19 -0.325,3.378; 20 -0.975,3.378; 21 -1.625,3.378; 22 -2.275,3.378; 23 -2.925,3.378; 24 -3.575,3.378
(OT)SOT-23(5PAD) = smd 0.6 x 1.1: 1 -0.95,-1.4; 2 0,-1.4; 3 0.95,-1.4; 4 0.95,1.4; 5 -0.95,1.4
WHISKER = drill 0.8 offset: P$1 0,0 | smd 1.27 x 2.54: P$2 0,5.08
SMDXTAL = smd 2 x 2.4: 1 -2,0; 2 2,0

### Placement (x,y rotation side)
ANT1  24.44,50.8 0 top
ANT2  39.46,50.8 0 top
ANT3  16.6,50.8 0 top
ANT4  31.63,50.8 0 bottom
B1  17.87,9.21 270 top
C1  16.07,33.75 0 top
C2  14.93,26.89 180 top
C3  25.87,15.49 0 top
C4  15.97,13.85 0 top
C5  26.05,40.42 270 top
C6  35.46,7.37 180 top
C7  19.78,60.52 180 top
C8  48.29,40.26 270 top
C9  50.45,40.26 270 top
C10  33.37,9.65 0 top
C11  36.29,9.65 180 top
C12  7.94,36.75 180 top
C13  17.21,40.31 0 top
C14  59.66,40.39 90 top
C15  17.21,44.17 0 top
C16  40.16,17.91 0 top
C17  14.89,24.7 180 top
CON1  8.86,23.88 90 top
CON2  28.03,43.18 0 bottom
CON5  27.53,13.33 0 bottom
CON7  64.81,40.51 0 top
F1  12.64,40.94 0 top
H1  2.63,40 0 top
H2  53.43,23.49 0 top
H3  73.28,15.25 0 top
H4  73.28,48.25 0 top
LED1  7.94,40.56 180 top
LED2  31.84,53.34 0 bottom
LED3  43.43,47.06 45 bottom
LED4  45.78,31.74 90 bottom
LED5  28.03,10.16 180 bottom
LED6  12.68,16.49 225 bottom
LED7  10.24,31.65 270 bottom
LED8  43.35,16.41 135 bottom
LED9  12.75,47.02 315 bottom
LED10  45.56,25.91 90 top
LED11  17.89,28.14 90 top
LED12  43.81,20.1 0 top
LED13  24.22,53.34 0 bottom
LED14  43.74,22 0 top
LED15  32.45,35.41 270 top
M1  38.64,16.83 180 top
PR1  35.46,49.47 90 top
R1  10.22,40.56 90 top
R2  70.83,35.05 270 top
R3  42,25.78 0 top
R4  43.02,29.59 0 top
R5  42,27.56 0 top
R6  39.18,57.19 270 top
R7  5.17,23.62 90 top
R8  17.87,9.21 90 top
R9  36.35,49.47 0 top
R10  30.07,55.24 0 top
R11  43.5,49.68 315 top
R12  47.71,33.44 270 top
R13  29.81,8.25 180 top
R14  12.63,13.85 135 top
R15  8.38,29.84 90 top
R16  36.1,4.25 270 top
R17  36.03,59.75 0 top
R18  50.93,48.54 315 top
R19  52.14,27.53 270 top
R20  23.84,3.81 180 top
R21  5.18,15.01 135 top
R22  22.06,55.05 0 top
R23  18.06,54.8 90 top
R24  1.99,35.94 90 top
R25  51.39,44.74 225 top
R26  11.33,54.55 45 top
R27  27.02,55.5 270 top
R28  20.41,12.89 270 top
R29  14.92,40.18 270 top
R30  17.21,42.21 180 top
R31  17.21,38.4 180 top
R32  17.21,36.5 180 top
R33  73.63,34.67 0 top
R34  49.63,24.42 180 top
R35  77.56,28.7 0 top
R36  33.62,55.24 180 top
R37  46.01,47.17 135 top
R38  47.69,29.91 90 top
R39  26.26,8.25 0 top
R40  10.09,16.45 315 top
R41  8.34,33.48 270 top
R42  7.94,38.65 0 top
R43  44.87,8.93 225 top
R44  12.65,49.61 225 top
R45  43.42,13.84 45 top
R46  45.97,16.35 225 top
R47  10.17,47.16 45 top
R48  71.47,21.21 0 top
R49  72.99,42.42 180 top
R50  72.36,25.27 90 top
R51  77.56,41.27 180 top
R52  24.19,10.52 90 top
R53  17.89,25.03 90 top
R54  40.49,20.08 0 top
R55  40.49,21.99 0 top
R56  34.37,35.38 90 top
R57  47.08,18.92 180 top
R58  41.94,24 0 top
R59  4.88,19.08 45 top
R60  12.19,33.45 270 top
R61  15.05,54.87 315 top
R62  40.5,12.35 225 top
SW1  21.56,43.37 270 top
T1  10.07,49.72 45 top
T2  46.07,13.74 225 top
T3  13.14,52.7 45 top
T4  31.84,57.15 0 top
T5  46.01,49.68 315 top
T6  49.46,31.66 270 top
T7  28.03,6.35 180 top
T8  10.14,13.84 135 top
T9  6.56,31.72 90 top
T10  24.22,57.15 0 top
T11  43.05,10.74 225 top
T12  14.95,10.79 270 top
T13  36.03,57.15 0 top
T14  49.1,46.73 315 top
T15  49.48,27.53 270 top
T16  23.84,6.35 180 top
T17  7.01,16.8 135 top
T18  4.61,35.92 90 top
T19  20.54,9.4 270 top
T20  19.84,57.66 0 top
T21  33.37,4.19 270 top
T22  71.85,31.62 90 top
T23  49.31,20.89 0 top
TST1  38.09,26.59 0 top
TST2  35.74,16.79 0 top
U2  12.38,37.38 270 top
U3  28.29,25.27 0 top
U4  37.43,34.1 0 top
U5  2.63,24.76 270 top
U6  53.43,38.73 90 top
U7  76.29,38.1 180 bottom
U8  76.29,25.4 0 bottom
U$1  42.45,39.94 270 top
V1  14.74,30.14 180 top
W1  72.23,44.45 270 top
W2  72.23,19.05 270 top
W3  75.28,31.75 270 top
XTAL1  34.89,12.38 180 top

### Tracks (layer width: path | path; a pad name or v marks a point on that pad's centre or on a via)
+3V  (via drill 0.51)
  Top 0.203: CON1.1 6.05,22.87 R7.1
  Top 0.254: R8.2 17.89,11.75 B1.1 | U$1.20 43.3,40.92 v42.77,41.4 | U3.P$64 22.29,34.26 22.25,34.29 | 22.25,34.29 21.43,34.29 v21.24,34.1 | 22.25,34.29 23.72,34.29 23.89,34.12 U3.P$62 | C6.1 36.46,7.45 36.42,7.49 37.81,7.49 38.57,8.25 v38.57,10.03 | C3.1 25.49,15.86 U3.P$21 25.49,18.93 24.99,19.43 v24.99,21.02 | LED14.2 44.5,20.16 LED12.2 45.91,20.1 v46.32,20.51 | v32.73,31.18 31.89,32.02 U3.P$52 31.89,34.1 LED15.2 | LED11.2 16.73,30.05 v16.73,30.1
  Top 0.406: LED13.1 25.49,54.04 23.52,56.01 21.94,56.01 21.68,56.26 21.68,59.36 C7.1 | U$1.20 48.2,40.92 C8.1 | C8.1 50.2,41.01 C9.1 | U$1.24 47.25,43.52 48.29,42.48 C8.1 | U$1.14 45.81,37 v45.81,35.31 | M1.P$1 39.41,16.05 C16.1 | B1.1 T12.2
  Top 0.61: C17.1 15.68,24.91 C2.1 15.68,28.73 V1.5 15.69,29.06 v16.73,30.1
  Route15 0.254: CON1.1 9.24,19.68 10.13,19.68
  pour Route15 (isolate 0.305, no thermals): 9.3,45.87 9.3,18.38 18.79,8.76 38.28,8.76 47.28,17.76 47.28,45.11 37.22,54.92 18.28,54.86
  pour Top (no thermals): 46.8,37.09 46.8,36.3 44.82,36.28 44.82,37.08
+VBAT  (via drill 0.51, 0.6)
  Top 0.254: U2.9 U2.10 | C13.1 15.55,39.42 R29.2
  Top 0.406: 13.29,38.54 F1.3 13.29,40.79 F1.8
  Top 0.61: v12.64,37.89 13.29,38.54 13.45,38.38 U2.10 14.58,39.08 R29.2 | SW1.5 SW1.2 21.56,43.37 v21.56,50.23
  Bottom 0.61: v12.64,37.89 14.05,37.89 C13.1 16.46,45.3 21.38,50.23 v21.56,50.23
  pour Top (no thermals): 13.97,37.89 13.97,38.46 15.18,38.46 15.18,37.89
+VCHG  (via drill 0.51)
  Top 0.254: 10.29,38.27 U2.1 U2.2 | LED1.2 7.3,40.42 | C12.1 R42.2
  Top 0.406: 10.35,42.21 8.57,42.21 7.18,40.82 LED1.2 | F1.5 12.64,43.99 12.13,44.5 10.99,44.5 10.35,43.86 10.35,42.21 | F1.1 11.52,40.03 11.24,40.31 11.24,41.96 10.99,42.21 10.35,42.21 | 7.3,40.42 7.3,40.31 8.44,39.17 R42.2 8.71,38.38 U2.1
  Top 0.61: v14.06,45.34 13.8,45.15 12.64,43.99
  Route15 0.61: v14.06,45.34 18.13,45.34 20.79,48.01 ANT1.P$2 ANT1.P$1
  pour Top (no thermals): 9.59,37.89 9.59,38.46 10.8,38.46 10.8,37.89
+VRAW  (via drill 0.51)
  Top 0.254: 11.99,41.22 F1.7 | V1.3 13.79,30.63 14.06,30.35 15.46,30.35 15.71,30.61 15.71,31.51 V1.1 | LED10.2 46.36,25.11 v45.56,25.91
  Top 0.406: 11.99,41.22 F1.6 11.99,42.86 v11.49,43.35 | F1.4 13.29,42.87 v13.78,43.36
  Top 0.61: C1.1 13.97,33.75 v13.94,33.78 13.79,33.63 V1.3
  Route15 0.61: v11.49,43.35 13.4,43.36 v13.78,43.36 13.94,43.2 v13.94,33.78
  Bottom 0.254: v45.56,25.91 45.56,22.54 40.67,17.84 34.19,17.84 31.21,20.83 28.22,20.83 25.37,17.97 23.02,17.97 22.19,17.14 15.91,17.14 15.02,18.03 15.02,20.19 15.52,20.7 15.52,28.51 13.94,30.1 v13.94,33.78
+VSENSE  (via drill 0.51)
  Top 0.254: R36.2 31.22,57.15 T4.1 | R37.2 45.66,50.04 T5.1 | T6.1 49.47,32.4 R38.2 | R39.2 28.66,6.35 T7.1 | R40.2 10.51,13.41 T8.1 | T1.1 9.42,49.08 R44.2 | U4.1 38.38,33.97 v38.89,33.46 | R45.2 46.7,14.37 T2.1
  Top 0.406: R41.2 T9.1 | C4.1 14.13,12.75 14.13,11.05 T12.3 13.3,10.22 v13.3,9.27 | C5.1 26.05,41.92 v24.86,43.12
  Route15 0.254: v38.89,33.46 44.23,33.46 45.11,34.35 46.83,34.35 48.16,35.69 | PR1.2 36.47,51.17 40.29,54.99
  Route15 0.406: v24.86,43.12 25.68,43.12 29.3,46.74 29.3,50.04 28.22,51.12 28.22,56.2
  Bottom 0.406: CON2.6 24.03,42.29 v24.86,43.12
  pour Route15 (isolate 0.305, rank 2, no thermals): 12.29,61.21 23.72,66.29 43.27,63.25 59.02,47.24 63.09,26.42 51.4,4.06 23.97,-4.06 0.35,8.64 -7.19,30.75 -4.35,48.01 9.75,60.2
AIN1
  Top 0.254: U$1.21 44.13,41.57 43.27,42.42 42.38,42.42 41.62,41.66 41.62,38.61 42.07,38.16 42.07,33.97 38.57,30.47 U3.P$47
AIN2
  Top 0.254: U$1.22 44.24,42.22 43.53,42.93 42.13,42.93 41.11,41.91 41.11,38.35 41.56,37.91 41.56,34.23 38.61,31.27 U3.P$48
APWM  (via drill 0.51)
  Top 0.254: U$1.23 44.35,42.87 43.78,43.43 41.88,43.43 40.61,42.16 40.61,38.1 41.05,37.66 41.05,35.5 v40.48,34.92 | U3.P$5 21.93,28.07 v24.22,25.78
  Bottom 0.254: v24.22,25.78 24.73,25.27 27.78,25.27 29.05,24 38.19,24 40.48,26.29 v40.48,34.92
BIN1
  Top 0.254: U$1.17 44.14,38.97 43.08,37.91 43.08,33.46 38.49,28.87 U3.P$45
BIN2
  Top 0.254: U$1.16 44.25,38.32 43.59,37.66 43.59,33.21 38.45,28.07 U3.P$44
BPWM  (via drill 0.51)
  Top 0.254: U$1.15 44.36,37.67 44.1,37.4 44.1,32.07 v43.78,31.75 | v22.57,25.08 22.25,25.4 22.25,26.86 21.84,27.27 U3.P$6
  Bottom 0.254: v43.78,31.75 43.78,28.64 38.51,23.37 28.86,23.37 27.59,24.64 23.02,24.64 v22.57,25.08
BUZZER  (via drill 0.51)
  Top 0.254: R28.1 18.57,15.48 18.57,18.35 17.75,19.18 v16.1,19.18 | U3.P$1 17.91,31.27 v17.3,31.88
  Bottom 0.254: v16.1,19.18 16.1,28.76 15.52,29.34 15.52,30.99 16.41,31.88 v17.3,31.88
CHGDETECT
  Top 0.254: U2.7 13.66,36.88 13.53,36.75 13.53,35.99 13.95,35.56 19.08,35.56 19.78,36.26 24.22,36.26 26.29,34.19 U3.P$59
CHGSTATUS
  Top 0.254: U2.4 11.87,36.88 13.7,35.05 19.4,35.05 20.03,35.69 23.97,35.69 25.49,34.17 U3.P$60
CRX  (via drill 0.51)
  Top 0.254: ANT4.P$1 ANT4.P$2 | v27.27,26.92 26.45,27.75 25.62,27.75 22.9,30.47 U3.P$2
  Bottom 0.254: v27.27,26.92 27.84,26.92 29.56,25.21 35.15,25.21 37.75,27.81 37.5,28.07 37.5,33.97 38.83,35.31 38.83,45.85 38.13,46.54 35.21,46.54 33.75,48.01 ANT4.P$2
CTX  (via drill 0.51)
  Top 0.254: ANT2.P$1 ANT2.P$2 | U3.P$3 22.55,29.67 v26,26.23
  Bottom 0.254: v26,26.23 26.32,25.91 28.03,25.91 29.3,24.64 37.88,24.64 39.91,26.67 39.91,34.04 39.34,34.61 39.34,47.88 ANT2.P$2
DATAANTENNA  (via drill 0.51)
  Top 0.254: U3.P$28 31.09,18.99 v31.34,19.24
  Bottom 0.254: v31.34,19.24 31.34,14.6 CON5.1
DEBUG1
  Top 0.254: U3.P$43 37.41,27.27 TST1.P$1
DEBUG2
  Top 0.254: TST2.P$1 36.04,17.09 U3.P$33
DISTANCELED  (via drill 0.51)
  Top 0.254: U3.P$50 33.49,31.95 v34.26,31.18 | R23.1 18.06,45.91 18.95,45.02 18.95,39.24 v20.92,37.27
  Bottom 0.254: 34.26,32.13 v34.26,31.18 35.59,29.84 35.59,26.48 34.96,25.84 29.94,25.84 27.78,28 25.94,28 22.51,31.43 22.51,35.69 v20.92,37.27
DISTANCERECEIVE
  Top 0.254: T10.2 25.49,55.88 26.38,54.99 27.01,54.99 R27.2 30.19,51.57 30.19,47.05 30.7,46.54 30.7,42.35 29.3,40.96 29.3,38.16 28.69,37.55 U3.P$56
ENCA  (via drill 0.51)
  Top 0.254: U5.3 4.16,22.22 6.7,19.68 12.16,19.68 v12.54,20.07 | v28.03,19.24 28.75,18.52 U3.P$25
  Bottom 0.254: v28.03,19.24 26.51,17.65 26.19,17.33 23.21,17.33 22.38,16.51 15.65,16.51 12.54,19.62 v12.54,20.07
ENCB  (via drill 0.51)
  Top 0.254: U3.P$26 29.49,16.2 29.75,15.94 31.08,15.94 32.22,14.8 v35.91,14.8 35.97,14.73
  Bottom 0.254: v35.91,14.8 36.03,14.67 40.67,14.67 41.31,14.03 43.34,14.03 51.21,21.91 51.21,24.57 54.83,28.19 54.83,39.88 U6.3
GND  (via drill 0.51, 0.6 pad 0.41)
  Top 0.254: C11.2 C10.2 34.12,10.41 34.89,11.18 v34.89,12.06 | R27.1 27.02,56.77 v27.65,57.4 | R9.1 v34.32,49.47 | R42.1 C12.2 7.18,36.23 7.86,35.56 9.76,35.56 v10.1,35.23 10.18,35.31 U2.5 | T16.2 24.79,4.01 R20.1 v24.6,2.54 | R24.1 2.2,34.97 T18.2 3.61,34 v2.51,32.89 | 5.74,14.48 6.03,14.48 T17.2 | R21.1 5.74,14.48 | 5.74,14.48 v8.29,11.94 | T11.2 45.33,9.8 | 45.33,9.8 45.4,9.73 | R43.1 45.4,9.87 | 45.4,9.87 v47.65,12.19 | 45.4,9.87 45.33,9.8 | T15.2 51.94,28.48 | 51.94,28.48 R19.1 | T14.2 50.1,49.07 R18.1 50.4,49.13 v48.16,51.43 | R26.1 10.8,53.7 T3.2 11.17,52.26 v8.41,52.26 | C15.2 R30.1 C13.2 R31.1 R32.1 18.56,36.5 v19.33,37.27 | 51.94,28.48 51.94,29.69 v52.99,30.73 | v32.42,60.9 33.56,59.75 R17.1 35.28,58.35 T13.2 | T19.2 21.75,10.35 v22.57,9.52 | U3.P$63 23.09,32.12 v24.1,31.11 | U3.P$53 v31.09,30.1 v31.08,30.1 | v26.19,20 26.29,19.84 U3.P$22 26.29,15.83 C3.2 | T20.2 18.83,58.8 | 34.45,7.35 C6.2 | C4.2 16.78,13.91 v18.25,13.91 | U4.3 36.86,33.02 v36.16,33.72
  Top 0.406: T20.2 18.89,59.93 C7.2 | v43.15,39.37 43.39,39.62 U$1.18 48.18,39.62 C8.2 50.2,39.51 C9.2 | U$1.9 38.73,37.97 v37.05,37.97 | U$1.4 38.73,41.91 v37.05,41.91 | 18.83,58.8 v17.49,58.8 | C16.2 v42.26,17.91 | T23.2 47.08,21.97 v46.96,22.1 | v23.02,38.48 24.86,38.48 C5.2
  Top 0.61: V1.2 14.74,32.43 14.95,32.64 16.48,32.64 16.82,32.98 C1.2 18.09,33.75 v18.13,33.78 | C17.2 14.18,24.99 C2.2 13.47,26.89 v11.9,28.45 | T21.2 34.45,7.35 | C6.2 v32.61,7.37
  Bottom 0.406: CON2.9 24.03,44.39 23.27,43.56 23.02,43.56 | 23.02,43.56 22.51,43.56 22.03,44.04 CON2.8 | 23.02,43.56 v23.02,38.48
  pour Route2 (isolate 0.305, no thermals): 12.29,61.21 23.72,66.29 43.27,63.25 55.78,48.89 55.78,12.45 51.4,4.06 23.97,-4.06 0.35,8.64 -14.19,30.75 -4.35,48.01 9.75,60.2
  pour Top (no thermals): 40.06,42.28 40.06,41.49 38.09,41.49 38.09,42.29
  pour Top (no thermals): 40.06,38.39 40.06,37.59 38.09,37.59 38.09,38.39
IRENABLE  (via drill 0.51)
  Top 0.254: U3.P$42 34.96,26.47 v34.32,27.11
  Bottom 0.254: v34.32,27.11 32.61,27.11 29.88,29.84 29.88,35.43 26.03,39.27 CON2.5
LED1
  Top 0.254: U3.P$39 37.63,24.07 39.46,25.91 39.46,28.32 40.73,29.59 R4.1
LED2
  Top 0.254: U3.P$38 37.59,23.27 39.97,25.65 39.97,26.28 R5.1
LED3
  Top 0.254: U3.P$37 37.55,22.47 40.73,25.65 R3.1
LED4
  Top 0.254: U3.P$7 19.52,26.47 19.14,26.1 19.14,24.51 18.91,24.28 R53.1
LED5
  Top 0.254: U3.P$34 39.73,20.07 R54.1
LED6
  Top 0.254: U3.P$35 37.73,20.87 38.83,21.97 39.72,21.97 R55.1
LED7
  Top 0.254: U3.P$49 34.29,34.55 R56.1
LEFTBUMPER  (via drill 0.51)
  Top 0.254: U3.P$40 31.93,24.87 v27.78,29.02 | v28.03,47.75 28.03,44.96 26.95,43.88 26.95,42.35 27.4,41.91 27.4,38.92 25.87,37.4 v25.87,36.58
  Bottom 0.254: v27.78,29.02 28.61,29.84 28.61,35.11 27.14,36.58 v25.87,36.58 | v28.03,47.75 CON2.11
LIGHTSENSE
  Top 0.254: 37.22,49.1 R9.2 36.85,49.16 PR1.1 35.44,47.75 33.56,47.75 31.4,45.59 31.4,42.1 30,40.7 30,37.85 29.49,37.33 U3.P$55
LINESENSE1  (via drill 0.51)
  Top 0.254: U3.P$58 27.09,37.85 28.03,38.8 v28.03,42.8
  Bottom 0.254: v28.03,42.8 CON2.4
LINESENSE2  (via drill 0.51)
  Top 0.254: U3.P$57 27.89,37.7 28.67,38.48 28.67,41.85 v29.68,42.86
  Bottom 0.254: v29.68,42.86 30.03,42.51 CON2.3
MA+  (via drill 0.51)
  Top 0.406: v34.57,43.31 34.7,43.18 38.45,43.18 38.78,43.52 U$1.1
  Bottom 0.406: 31.97,45.52 CON2.13 32.03,44.26 32.99,43.31 v34.57,43.31
  pour Top (no thermals): 40.06,43.59 40.06,42.8 38.09,42.8 38.09,43.6
MA-  (via drill 0.51)
  Top 0.406: v35.65,41.02 36.03,40.64 38.32,40.64 38.6,40.92 U$1.5
  Bottom 0.406: CON2.14 35.65,43.96 v35.65,41.02
  pour Top (no thermals): 40.06,40.99 40.06,40.2 38.09,40.2 38.09,41
MB+  (via drill 0.51)
  Top 0.406: v32.1,38.73 33.11,37.72 35.4,37.72 36.42,36.7 38.19,36.7 38.51,37.02 U$1.11
  Bottom 0.406: CON2.2 32.1,40.72 v32.1,38.73
  pour Top (no thermals): 40.06,37.09 40.06,36.3 38.09,36.3 38.09,37.1
MB-  (via drill 0.51)
  Top 0.406: v34.51,38.73 35.02,39.24 38.07,39.24 38.34,38.97 U$1.8
  Bottom 0.406: CON2.1 34.03,39.21 v34.51,38.73
  pour Top (no thermals): 40.06,39.68 40.06,38.89 38.09,38.89 38.09,39.69
MISO  (via drill 0.51)
  Top 0.254: CON1.6 10.46,21.67 U3.P$13 22.11,21.67 v22.25,21.65 | R61.2 15.91,54.67 v15.91,56.2
  Bottom 0.254: v15.91,56.2 12.98,53.28 12.98,49.66 10.38,47.05 10.38,37.21 12.48,35.11 14.95,35.11 17.24,32.83 18.19,32.83 20.41,30.61 20.41,22.73 21.49,21.65 v22.25,21.65
MOSI  (via drill 0.51)
  Top 0.254: CON1.2 8.99,22.47 U3.P$12 21.55,22.47 21.75,22.67 23.4,22.67 v23.78,22.29 | v45.94,44.77 45.69,44.51 44.1,44.51 41.11,47.5 41.11,54.5 R6.2
  Bottom 0.254: v23.78,22.29 23.78,22.99 24.86,24.07 27.27,24.07 28.61,22.73 38.76,22.73 44.16,28.13 45.75,28.13 47.08,29.46 47.08,43.62 v45.94,44.77
N$1
  Top 0.254: R1.2 9.44,41.31 LED1.1
N$2
  Top 0.254: R50.2 72.36,31.05 T22.3 74.58,33.27 75.02,33.27 76.81,35.06 R51.2
N$3
  Top 0.254: T2.2 43.08,10.75 T11.1 44.04,8.4 R43.2
N$4
  Top 0.254: T22.1 70.83,32.64 R2.2
N$5  (via drill 0.51)
  Top 0.61: v20.29,39.37 20.16,39.5 SW1.3 SW1.6
  Bottom 0.406: 22.06,40 22.06,40.75 CON2.7
  Bottom 0.61: v20.29,39.37 21.43,39.37 22.06,40
N$6
  Top 0.254: T1.2 13.11,52.76 T3.1 12.1,55.08 R26.2
N$7
  Top 0.406: R57.1 48.42,18.92 T23.3
N$8  (via drill 0.51)
  Top 0.254: v30.19,19.87 30.29,19.78 U3.P$27
  Bottom 0.254: CON5.2 30.19,16 v30.19,19.87
N$9
  Top 0.254: R8.1 17.89,6.67 B1.2 19.46,8.25 T19.3
N$10  (via drill 0.51, 0.6)
  Top 0.254: R10.1 29.56,55.24 29.3,55.5 | R11.1 43.07,50.32 | R14.1 12.98,13.02
  Top 0.61: R47.1 8.09,46.63 5.05,43.58 v5.05,43.5 | v29.43,61.21 29.32,61.1 R10.1 | 43.07,50.32 43.07,52.12 v46.13,55.18 | R12.1 48.32,34.8 50.39,34.8 51.4,33.78 v53.43,33.78 | R46.1 47.61,16.88 v51.53,12.95 | R13.1 31.21,7.61 31.21,4.19 | 31.21,4.19 v31.21,1.52 | T21.3 31.21,4.19 | 12.98,13.02 12.98,12 v9.75,8.76 | R15.1 7.87,28.57 5.05,28.57 2.76,30.86 v1.11,30.86
  Route15 0.61: v5.05,43.5 5.05,38.73 1.11,34.8 v1.11,30.86 1.11,17.4 v9.75,8.76 13.68,4.83 15.46,4.83 17.24,3.05 20.03,3.05 21.56,1.52 v31.21,1.52 34.26,1.52 36.29,3.56 39.84,3.56 41.88,5.59 44.48,5.59 48.29,9.4 49.37,9.4 50.89,10.92 50.89,12.32 v51.53,12.95 54.58,16 54.58,19.18 51.15,22.61 51.15,24.51 54.96,28.32 54.96,33.65 | 54.96,33.65 54.96,46.48 52.54,48.89 52.54,50.16 51.02,51.69 51.02,52.2 48.67,54.55 v46.13,55.18 40.35,59.69 37.81,59.69 36.29,61.21 33.49,62.17 30.38,62.17 v29.43,61.21 | v53.43,33.78 54.83,33.78 54.96,33.65
N$11
  Top 0.254: T21.1 35.83,3.24 R16.2
N$12
  Top 0.254: R22.1 21.31,55.18
  Top 0.406: 21.31,55.18 T20.3
N$13
  Top 0.61: R10.2 30.57,55.24 LED2.2
N$14
  Top 0.61: LED3.2 43.85,49.28 R11.2
N$15
  Top 0.61: R12.2 46.1,32.69 LED4.2
N$16
  Top 0.61: R13.2 29.06,9.92 LED5.2
N$17
  Top 0.61: R14.2 13.32,15.59 LED6.2
N$18
  Top 0.61: LED7.2 10.03,30.59 R15.2
N$19
  Top 0.254: R23.2 18.08,56.46 20.27,58.66 T20.1
N$20
  Top 0.61: R46.2 44.25,17 LED8.2
N$21
  Top 0.61: LED9.2 11.86,46.54 R47.2
N$22
  Top 0.254: U2.8 15.44,37.38 R31.2
N$23
  Top 0.254: C10.1 32.62,12.17 XTAL1.2 30.48,14.73 28.8,14.73 27.09,16.44 U3.P$23
N$24
  Top 0.254: C11.1 37.04,12.3 XTAL1.1 35.11,14.22 31.97,14.22 30.83,15.37 29.18,15.37 27.89,16.66 U3.P$24
N$25
  Top 0.406: R22.2 22.95,55.11 LED13.2
N$26
  Top 0.254: T19.1 20.49,9.5 20.41,9.57 R28.2
N$27
  Top 0.254: R17.2 36.78,58.35 T13.1 35.98,57.15 T4.2
N$28
  Top 0.254: U2.6 16.31,36.38 R32.2
N$29
  Top 0.254: U7.P$2 78.31,39.02 R51.1
N$30
  Top 0.254: LED10.1 43.51,25.65 R3.2
N$31
  Top 0.254: R4.2 44.54,29.59 46.36,27.77 LED10.3
N$32
  Top 0.254: LED10.4 44.61,27.56 R5.2
N$33
  Top 0.254: U2.3 11.11,37.38 11.24,37.51 11.24,38.78 11.11,38.91 10.48,38.91 10.22,39.16 R1.1
N$34
  Top 0.254: R24.2 2.17,36.87 T18.1 4.54,35.95 4.54,35.02 T9.2
N$35
  Top 0.254: T8.2 7.21,16.77 T17.1 4.65,15.79 R21.2
N$36
  Top 0.254: T7.2 23.89,6.35 T16.1 22.89,4.01 R20.2
N$37
  Top 0.254: T6.2 49.46,27.6 T15.1 51.95,26.58 R19.2
N$38
  Top 0.254: R18.2 51.46,47.75 T14.1 48.94,46.76 T5.2
N$39
  Top 0.254: U8.P$2 74.27,24.52 R50.1
N$43
  Top 0.254: R53.2 LED11.1
N$44
  Top 0.254: R58.2 42.89,24 43.78,23.11 49.11,23.11 T23.1
N$45
  Top 0.254: R54.2 43.04,20.08 LED12.1
N$46
  Top 0.254: R55.2 42.98,21.99 LED14.1
N$47
  Top 0.254: LED15.1 34.34,36.16 R56.2
N$48
  Top 0.406: M1.P$2 37.64,18.11 38.45,18.92 R57.2
PB0  (via drill 0.51)
  Top 0.254: R34.2 47.65,25.64 v47.65,25.84 | U3.P$10 24.92,24.07 v26.64,22.35
  Bottom 0.254: v26.64,22.35 27.53,21.46 39.21,21.46 44.73,26.99 46.19,26.99 47.34,25.84 v47.65,25.84
PB4  (via drill 0.51)
  Top 0.254: U3.P$14 14.3,20.87 v14.13,20.83 | v12.16,30.48 12.19,30.51 R60.2
  Bottom 0.254: v12.16,30.48 12.16,29.84 13.05,28.96 13.05,21.91 v14.13,20.83
PB5
  Top 0.254: U3.P$15 15.28,20.07 14.13,18.92 11.52,18.92 11.14,18.54 6.48,18.54 R59.2
PB6
  Top 0.254: R52.2 20.54,15.05 U3.P$16
PB7  (via drill 0.51)
  Top 0.254: R62.2 39.34,12.45 v39.34,13.72 | v22.32,14.92 22.29,15.02 U3.P$17
  Bottom 0.254: v39.34,13.72 39.34,12.19 37.56,10.79 30.95,10.79 30.19,11.56 24.1,11.56 22.32,13.33 v22.32,14.92
RESET  (via drill 0.51)
  Top 0.203: R7.2 5.95,25.15 8.86,25.15 CON1.4
  Top 0.254: v23.59,19.81 24.69,18.71 U3.P$20 24.69,16.53 24.41,16.26 23.78,16.26 v23.4,15.87
  Bottom 0.254: CON1.4 11.46,25.08 11.46,19.81 15.4,15.87 v23.4,15.87
RIGHTBUMPER  (via drill 0.51)
  Top 0.254: U3.P$41 32.59,25.67 v31.27,26.99
  Bottom 0.254: v31.27,26.99 29.24,29.02 29.24,35.31 25.05,39.5 25.05,42.04 26.03,43.02 CON2.10
RX1
  Top 0.254: R36.1 35.28,56.15 T13.3 36.48,56.07 38.35,57.94 R6.1
RX2
  Top 0.254: R37.1 47.77,46.64 T14.3 48.7,45.59 51.6,45.59 R25.1
RX3
  Top 0.254: R38.1 48.48,28.36 T15.3 49.62,26.31 49.62,25.17 R34.1
RX4
  Top 0.254: R39.1 24.75,8.25 | 24.75,8.25 T16.3 | 24.75,8.25 24.19,8.81 R52.1
RX5
  Top 0.254: R40.1 9.04,17.51 T17.3 7.43,17.91 5,17.91 R59.1
RX6
  Top 0.254: R41.1 8.35,34.21 8.4,34.39 | 8.4,34.39 7.13,34.41 T18.3 | 8.4,34.39 8.59,34.2 R60.1
RX7
  Top 0.254: R44.1 13.18,51.32 T3.3 14.52,52.55 R61.1
RX8
  Top 0.254: R45.1 42.88,11.99 T11.3 41.03,12.76 R62.1
S+VSENSE  (via drill 0.51)
  Top 0.254: C14.1 v59.66,38.1 v59.66,38.11 CON7.1 | W3.P$1 W3.P$2
  pour Route15 (isolate 0.305, no thermals): 58.28,53.85 82.9,53.85 82.77,10.41 58.28,10.41
SCK  (via drill 0.51)
  Top 0.254: CON1.5 10.73,23.27 U3.P$11 24.51,23.27 v25.05,22.73 | R25.2 48.15,44.21 v47.65,44.7
  Bottom 0.254: v47.65,44.7 47.65,29.21 46,27.56 44.48,27.56 39.02,22.1 28.35,22.1 27.02,23.43 25.75,23.43 v25.05,22.73
SEN  (via drill 0.51)
  Top 0.254: T12.1 14.95,10.92 14.95,12.13 15.97,13.14 15.97,17.02 v17.11,18.16 | U3.P$4 19.25,28.87 18.95,29.17 18.95,29.91 18.64,30.23 v18.32,30.23
  Bottom 0.254: v17.11,18.16 17.18,18.22 17.11,29.02 v18.32,30.23
SGND  (via drill 0.51)
  Top 0.254: C14.2 v59.66,42.93 59.68,42.91 CON7.8 | R48.1 v70.71,22.73 | R49.1 v75.15,42.42 | T22.2 70.71,29.59 v70.71,28.83 | R35.1 v75.4,28.7 | R33.1 72.86,34.68 v72.86,36.07
  pour Route2 (isolate 0.305): 58.28,53.85 82.9,53.85 82.77,10.41 58.28,10.41
SIRENABLE  (via drill 0.51)
  Top 0.254: CON7.2 63.81,39.16 v62.2,40.77 | R2.1 v70.83,37.08
  Bottom 0.254: v70.83,37.08 64.1,37.08 62.2,38.99 v62.2,40.77
SLEFTBUMPER
  Top 0.254: W1.P$2 W1.P$1 72.24,44.44 R49.2 70.97,41.15 66.13,41.15 65.81,41.47 CON7.6
SLINESENSE1  (via drill 0.51)
  Top 0.254: U8.P$4 78.31,26.32 R35.2 v80.36,28.7 | CON7.3 65.75,38.16 65.75,39.75 66.39,40.39 v72.74,40.39
  Bottom 0.254: v72.74,40.39 75.28,40.39 76.29,39.37 76.29,34.92 78.2,33.02 78.2,30.86 v80.36,28.7
SLINESENSE2
  Top 0.254: R33.2 74.4,37.09 U7.P$4 72,39.5 68.67,39.5 67.81,38.63 CON7.4
SRIGHTBUMPER  (via drill 0.51)
  Top 0.254: W2.P$2 W2.P$1 72.22,19.06 R48.2 72.22,23 69.31,25.91 v69.31,38.35 | v64.36,40.26 63.81,40.81 CON7.7
  Bottom 0.254: v69.31,38.35 66.13,38.35 v64.36,40.26
STBY
  Top 0.254: U$1.19 43.77,40.27 43.65,40.39 42.64,40.39 42.13,39.88 42.13,38.86 42.57,38.42 42.57,33.72 38.53,29.67 U3.P$46
TEMPSENSE
  Top 0.254: U3.P$54 30.29,33.05 30.32,33.08 30.32,35.69 31.72,37.08 35.08,37.08 36.48,35.68 U4.2
TRANSMITLEDS
  Top 0.254: R16.1 36.85,5 39.46,7.62 39.46,10.79 38.32,11.94 38.32,13.65 36.22,15.75 32.16,15.75 31.89,16.02 U3.P$29
VBATSENSE  (via drill 0.51)
  Top 0.254: 15.18,40.75 R29.1 14.92,41.96 v15.18,42.21 R30.2 C15.1 | U3.P$61 24.69,34.14 23.72,35.11 20.73,35.11 19.91,34.29 v19.91,32.96
  Bottom 0.254: v19.91,32.96 19.91,34.16 17.81,36.26 12.35,36.26 11.59,37.02 11.59,38.68 v15.18,42.21
VIBE
  Top 0.254: U3.P$36 37.64,21.67 39.97,24 R58.1

### Text on the board
tPlace: RXI | GND | TXO | PWR | OFF | SwarmBoard V3 | CHGSTATUS | ON | 3-17-14 | CPRC | ENCB | ENCA | KEY | RXI | TXO
bPlace: DIST
tDocu: Long lead = circle for IR detector